# Altium project compute_fpga.PrjPcb (part 1 of 2)
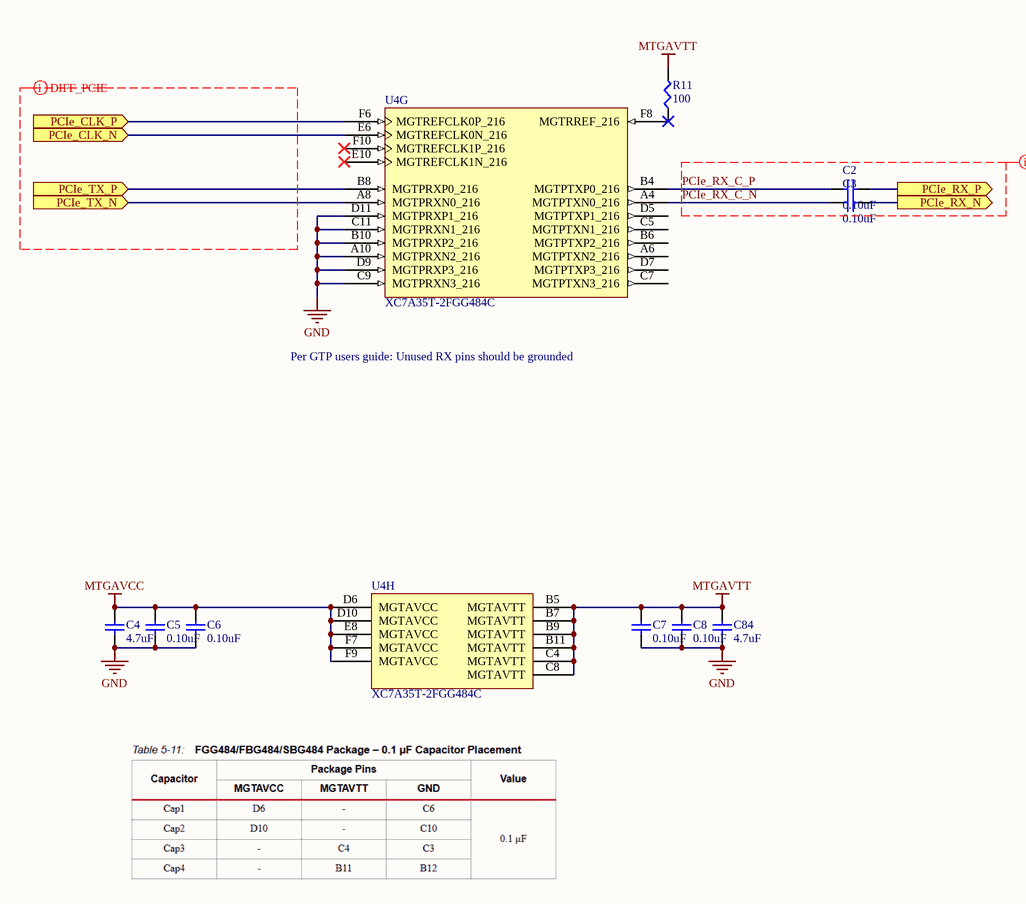
[diagram p0: FPGA PCIe.SchDoc]
Project: Raspberry Pincushion; VersionRevision: Rev0
14 sheets, 176 parts. Net scope: flat (ports and power ports of the same name join across sheets).
Board file: PCB1.PcbDoc
Sheets:
  FPGA PCIe.SchDoc
  FPGA power.SchDoc
  FPGA programming.SchDoc
  compute module.SchDoc
  compute module unused.SchDoc
  compute module power.SchDoc
  Block Diagram.SchDoc
  compute module Ethernet.SchDoc
  compute module HDMI out.SchDoc
  compute module microsd.SchDoc
  compute module USB.SchDoc
  FPGA GPIO.SchDoc
  FPGA power supply.SchDoc
  FPGA sdram.SchDoc

## Sheet FPGA PCIe.SchDoc: FPGA PCIe
size A4; Organization: Blinkinlabs, LLC; DocumentNumber: 10; SheetNumber: 11; SheetTotal: 14

### Parts
C2  0.10uF  [CAPC0603X03L]
C3  0.10uF  [CAPC0603X03L]
C4  4.7uF  [CAPC1005X06L]
C5  0.10uF  [CAPC0603X03L]
C6  0.10uF  [CAPC0603X03L]
C7  0.10uF  [CAPC0603X03L]
C8  0.10uF  [CAPC0603X03L]
C84  4.7uF  [CAPC1005X06L]
R11  100  [ERJ2G(0402)_L]
U4  XC7A35T-2FGG484C  [FGG484]  (parts G,H of 12)

### Ports
PCIe_CLK_N (in), PCIe_CLK_P (in), PCIe_RX_N (out), PCIe_RX_P (out), PCIe_TX_N (in), PCIe_TX_P (in)

### Nets
GND: C4.1 C5.2 C6.2 C7.2 C8.2 C84.1 U4.A10(MGTPRXN2_216) U4.B10(MGTPRXP2_216) U4.C9(MGTPRXN3_216) U4.C11(MGTPRXN1_216) U4.D9(MGTPRXP3_216) U4.D11(MGTPRXP1_216)
MTGAVCC: C4.2 C5.1 C6.1 U4.D6(MGTAVCC) U4.D10(MGTAVCC) U4.E8(MGTAVCC) U4.F7(MGTAVCC) U4.F9(MGTAVCC)
MTGAVTT: C7.1 C8.1 C84.2 R11.2 U4.B5(MGTAVTT) U4.B7(MGTAVTT) U4.B9(MGTAVTT) U4.B11(MGTAVTT) U4.C4(MGTAVTT) U4.C8(MGTAVTT)
PCIe_CLK_N: U4.E6(MGTREFCLK0N_216) ; port PCIe_CLK_N
PCIe_CLK_P: U4.F6(MGTREFCLK0P_216) ; port PCIe_CLK_P
PCIe_RX_C_N: C3.1 U4.A4(MGTPTXN0_216)
PCIe_RX_C_P: C2.1 U4.B4(MGTPTXP0_216)
PCIe_RX_N: C3.2 ; port PCIe_RX_N
PCIe_RX_P: C2.2 ; port PCIe_RX_P
PCIe_TX_N: U4.A8(MGTPRXN0_216) ; port PCIe_TX_N
PCIe_TX_P: U4.B8(MGTPRXP0_216) ; port PCIe_TX_P
NetR11_1: R11.1 U4.F8(MGTRREF_216)

Not connected (* = marked no-connect by the designer): U4 A6(MGTPTXN2_216) B6(MGTPTXP2_216) C5(MGTPTXN1_216) C7(MGTPTXN3_216) D5(MGTPTXP1_216) D7(MGTPTXP3_216) E10(MGTREFCLK1N_216)* F10(MGTREFCLK1P_216)*

### Layout directives
differential pair; differential pair class DIFF_90Ohm_PCIE; differential pair class DIFF_PCIE; net class PCIE; rule Matched Net Lengths [Tolerance = 0.1mm]: (no net found under the mark), PCIe_RX_C_N, PCIe_RX_C_P

### Notes on the sheet
- Per GTP users guide: Unused RX pins should be grounded
- Title:
- Project:
- Revision:
- Date:
- Time:
- Sheet
- of

### Library data of the parts
C2 C3 C5-C8 = GRM033R60J104KE19J: CAP CER 0.1UF 6.3V X5R 0201; Manufacturer: Murata Electronics North America; Tolerance: ±10%; Datasheets: http://www.murata.com/~/media/webrenewal/support/library/catalog/products/capacitor/mlcc/c02e.pdf; Image: //media.digikey.com/Renders/Murata%20Renders/ZRB-SERIES-0402.jpg; Digi-Key Part Number: 490-8155-1-ND; Packaging: Cut Tape (CT); Series: GRM; Value: 0.10uF; Voltage: 6.3V; Temperature Coefficient: X5R; Operating Temperature: -55°C ~ 85°C; Features: -; Applications: General Purpose; Mounting Type: 0201 (0603 Metric); Package / Case: 0.024" L x 0.012" W (0.60mm x 0.30mm); Case/Package: 0201
C4 C84 = GRM155R60G475ME47D: CAP CER 4.7UF 4V X5R 0402; Manufacturer: Murata Electronics North America; Tolerance: ±20%; PartNumber: GRM155R60G475ME47D; Datasheets: http://www.murata.com/~/media/webrenewal/support/library/catalog/products/capacitor/mlcc/c02e.pdf; Image: //media.digikey.com/Renders/Murata%20Renders/ZRB-SERIES-0402.jpg; Digi-Key Part Number: 490-11980-1-ND; Packaging: Cut Tape (CT); Series: GRM; Value: 4.7uF; Voltage: 4V; Temperature Coefficient: X5R; Operating Temperature: -55°C ~ 85°C; Features: -; Applications: General Purpose; Package / Case: 0402 (1005 Metric); Case/Package: 0402
R11 = ERJ-2RKF1000X: RES SMD 100 OHM 1% 1/10W 0402; Manufacturer: Panasonic Electronic Components; Power (Watts): 0.1W, 1/10W; Temperature Coefficient: ±100ppm/°C; PartNumber: ERJ-2RKF1000X; Datasheets: http://industrial.panasonic.com/www-cgi/jvcr13pz.cgi?E+PZ+3+AOA0002+ERJ2RKF1000X+7+WW; Image: //media.digikey.com/Photos/Panasonic%20Photos/ERJ-PA2-Series.jpg; Digi-Key Part Number: P100LCT-ND; Series: ERJ; Value: 100; Tolerance: ±1%; Composition: Thick Film; Features: Automotive AEC-Q200; Operating Temperature: -55°C ~ 155°C; Package / Case: 0402 (1005 Metric); Case/Package: 0402; Size / Dimension: 0.039" L x 0.020" W (1.00mm x 0.50mm); Height - Seated (Max): 0.016" (0.40mm); Number of Terminations: 2
U4 = CMP-0383-00019-1: Artix-7 FPGA, 250 User I/Os, 4 GTP, 484-Ball BGA, Speed Grade 2, Commercial Grade, Pb-Free; Manufacturer: Xilinx; Total Block RAM: 1800 Kb; GTP: 4; Available User I/O: 250; Speed Grades: 2; Logic Cells: 33280; CMTs: 5; ComponentLink3URL: http://www.xilinx.com/support/documentation/user_guides/ug475_7Series_Pkg_Pinout.pdf; PackageVersion: Rev. 1.11; ComponentLink2Description: Datasheet; ComponentLink3Description: Pinout; PartNumber: XC7A35T-2FGG484C; DatasheetVersion: Rev. 1.15; Operating Temperature Range: Commercial; PackageDescription: 484-Ball Wire-Bond Fine-Pitch BGA, Body 23 x 23 mm, Pitch 1 mm; ComponentLink4Description: Package Specification; Maximum Distributed RAM: 400 Kb; Mounting Technology: Surface Mount; ComponentLink2URL: http://www.xilinx.com/support/documentation/data_sheets/ds180_7Series_Overview.pdf; ComponentLink1Description: Manufacturer URL; ComponentLink4URL: http://www.xilinx.com/support/documentation/user_guides/ug475_7Series_Pkg_Pinout.pdf; PackageReference: FGG484; ComponentLink1URL: http://www.xilinx.com/

## Sheet FPGA power.SchDoc: FPGA power
size A4; Organization: Blinkinlabs, LLC; DocumentNumber: 11; SheetNumber: 12; SheetTotal: 14
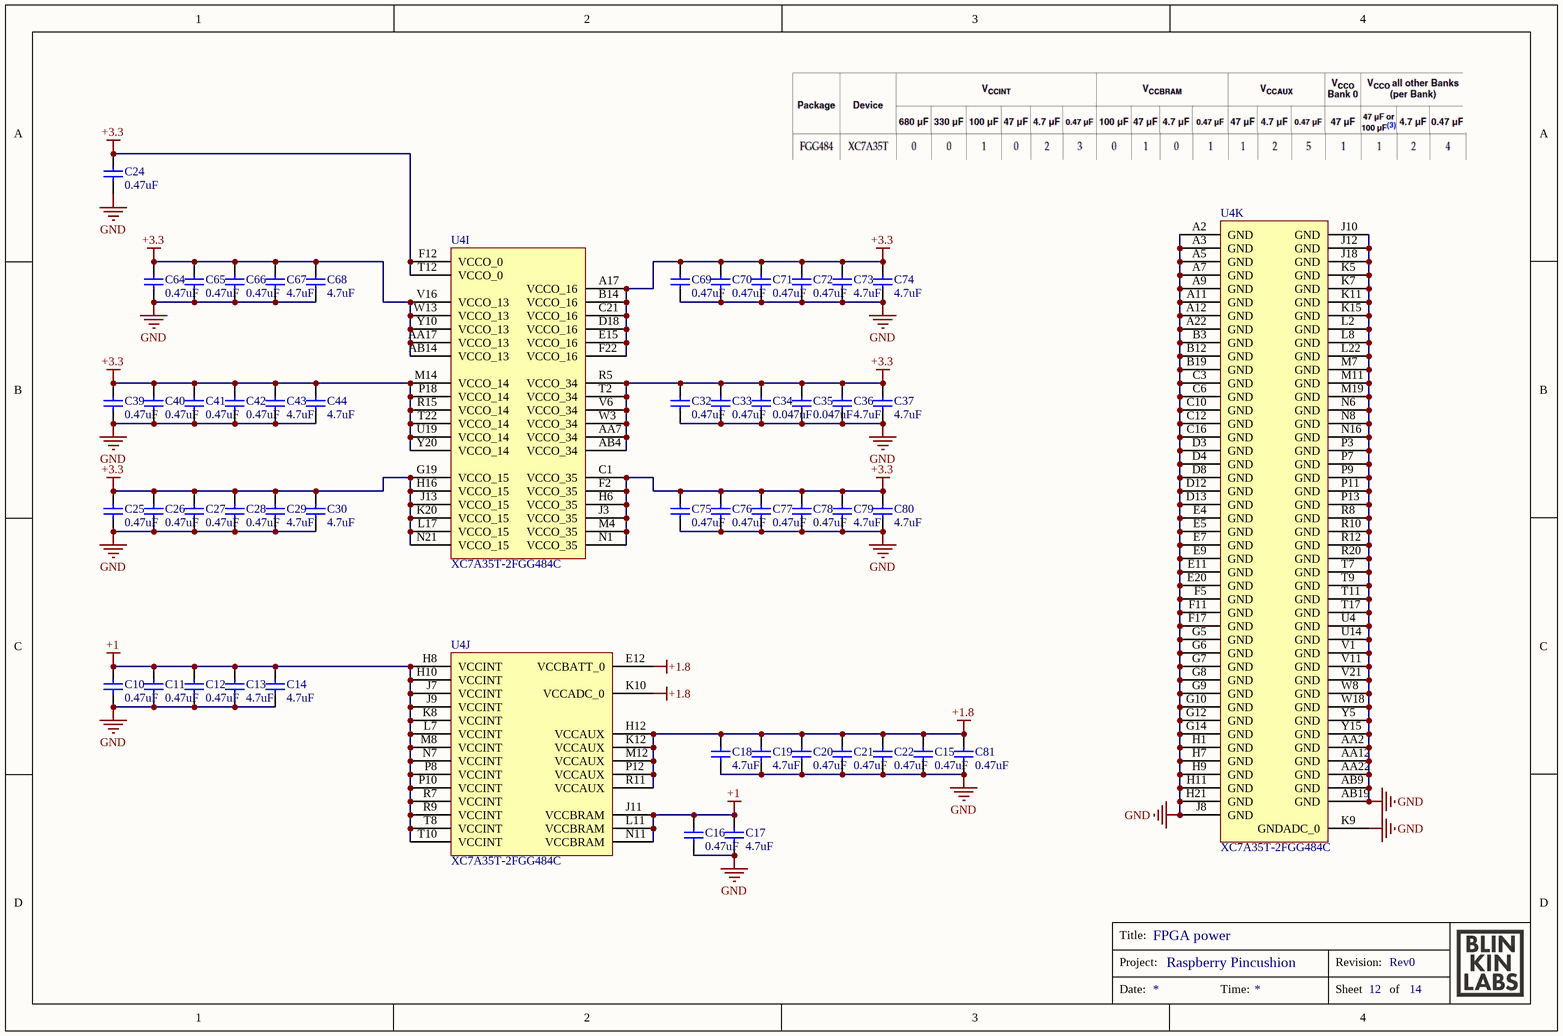
[diagram p1: FPGA power.SchDoc]

### Parts
C10  0.47uF  [CAPC1005X06L]
C11  0.47uF  [CAPC1005X06L]
C12  0.47uF  [CAPC1005X06L]
C13  4.7uF  [CAPC1005X06L]
C14  4.7uF  [CAPC1005X06L]
C15  0.47uF  [CAPC1005X06L]
C16  0.47uF  [CAPC1005X06L]
C17  4.7uF  [CAPC1005X06L]
C18  4.7uF  [CAPC1005X06L]
C19  4.7uF  [CAPC1005X06L]
C20  0.47uF  [CAPC1005X06L]
C21  0.47uF  [CAPC1005X06L]
C22  0.47uF  [CAPC1005X06L]
C24  0.47uF  [CAPC1005X06L]
C25  0.47uF  [CAPC1005X06L]
C26  0.47uF  [CAPC1005X06L]
C27  0.47uF  [CAPC1005X06L]
C28  0.47uF  [CAPC1005X06L]
C29  4.7uF  [CAPC1005X06L]
C30  4.7uF  [CAPC1005X06L]
C32  0.47uF  [CAPC1005X06L]
C33  0.47uF  [CAPC1005X06L]
C34  0.047uF  [CAPC1005X06L]
C35  0.047uF  [CAPC1005X06L]
C36  4.7uF  [CAPC1005X06L]
C37  4.7uF  [CAPC1005X06L]
C39  0.47uF  [CAPC1005X06L]
C40  0.47uF  [CAPC1005X06L]
C41  0.47uF  [CAPC1005X06L]
C42  0.47uF  [CAPC1005X06L]
C43  4.7uF  [CAPC1005X06L]
C44  4.7uF  [CAPC1005X06L]
C64  0.47uF  [CAPC1005X06L]
C65  0.47uF  [CAPC1005X06L]
C66  0.47uF  [CAPC1005X06L]
C67  4.7uF  [CAPC1005X06L]
C68  4.7uF  [CAPC1005X06L]
C69  0.47uF  [CAPC1005X06L]
C70  0.47uF  [CAPC1005X06L]
C71  0.47uF  [CAPC1005X06L]
C72  0.47uF  [CAPC1005X06L]
C73  4.7uF  [CAPC1005X06L]
C74  4.7uF  [CAPC1005X06L]
C75  0.47uF  [CAPC1005X06L]
C76  0.47uF  [CAPC1005X06L]
C77  0.47uF  [CAPC1005X06L]
C78  0.47uF  [CAPC1005X06L]
C79  4.7uF  [CAPC1005X06L]
C80  4.7uF  [CAPC1005X06L]
C81  0.47uF  [CAPC1005X06L]
U4  XC7A35T-2FGG484C  [FGG484]  (parts I,J,K of 12)

### Nets
+1: C10.1 C11.1 C12.1 C13.2 C14.2 C16.1 C17.2 U4.H8(VCCINT) U4.H10(VCCINT) U4.J7(VCCINT) U4.J9(VCCINT) U4.J11(VCCBRAM) U4.K8(VCCINT) U4.L7(VCCINT) U4.L11(VCCBRAM) U4.M8(VCCINT) U4.N7(VCCINT) U4.N11(VCCBRAM) U4.P8(VCCINT) U4.P10(VCCINT) U4.R7(VCCINT) U4.R9(VCCINT) U4.T8(VCCINT) U4.T10(VCCINT)
+1.8: C15.1 C18.2 C19.2 C20.1 C21.1 C22.1 C81.1 U4.E12(VCCBATT_0) U4.H12(VCCAUX) U4.K10(VCCADC_0) U4.K12(VCCAUX) U4.M12(VCCAUX) U4.P12(VCCAUX) U4.R11(VCCAUX)
+3.3: C24.1 C25.1 C26.1 C27.1 C28.1 C29.2 C30.2 C32.1 C33.1 C34.1 C35.1 C36.2 C37.2 C39.1 C40.1 C41.1 C42.1 C43.2 C44.2 C64.1 C65.1 C66.1 C67.2 C68.2 C69.1 C70.1 C71.1 C72.1 C73.2 C74.2 C75.1 C76.1 C77.1 C78.1 C79.2 C80.2 U4.A17(VCCO_16) U4.AA7(VCCO_34) U4.AA17(VCCO_13) U4.AB4(VCCO_34) U4.AB14(VCCO_13) U4.B14(VCCO_16) U4.C1(VCCO_35) U4.C21(VCCO_16) U4.D18(VCCO_16) U4.E15(VCCO_16) U4.F2(VCCO_35) U4.F12(VCCO_0) U4.F22(VCCO_16) U4.G19(VCCO_15) U4.H6(VCCO_35) U4.H16(VCCO_15) U4.J3(VCCO_35) U4.J13(VCCO_15) U4.K20(VCCO_15) U4.L17(VCCO_15) U4.M4(VCCO_35) U4.M14(VCCO_14) U4.N1(VCCO_35) U4.N21(VCCO_15) U4.P18(VCCO_14) U4.R5(VCCO_34) U4.R15(VCCO_14) U4.T2(VCCO_34) U4.T12(VCCO_0) U4.T22(VCCO_14) U4.U19(VCCO_14) U4.V6(VCCO_34) U4.V16(VCCO_13) U4.W3(VCCO_34) U4.W13(VCCO_13) U4.Y10(VCCO_13) U4.Y20(VCCO_14)
GND: C10.2 C11.2 C12.2 C13.1 C14.1 C15.2 C16.2 C17.1 C18.1 C19.1 C20.2 C21.2 C22.2 C24.2 C25.2 C26.2 C27.2 C28.2 C29.1 C30.1 C32.2 C33.2 C34.2 C35.2 C36.1 C37.1 C39.2 C40.2 C41.2 C42.2 C43.1 C44.1 C64.2 C65.2 C66.2 C67.1 C68.1 C69.2 C70.2 C71.2 C72.2 C73.1 C74.1 C75.2 C76.2 C77.2 C78.2 C79.1 C80.1 C81.2 U4.A2(GND) U4.A3(GND) U4.A5(GND) U4.A7(GND) U4.A9(GND) U4.A11(GND) U4.A12(GND) U4.A22(GND) U4.AA2(GND) U4.AA12(GND) U4.AA22(GND) U4.AB9(GND) U4.AB19(GND) U4.B3(GND) U4.B12(GND) U4.B19(GND) U4.C3(GND) U4.C6(GND) U4.C10(GND) U4.C12(GND) U4.C16(GND) U4.D3(GND) U4.D4(GND) U4.D8(GND) U4.D12(GND) U4.D13(GND) U4.E4(GND) U4.E5(GND) U4.E7(GND) U4.E9(GND) U4.E11(GND) U4.E20(GND) U4.F5(GND) U4.F11(GND) U4.F17(GND) U4.G5(GND) U4.G6(GND) U4.G7(GND) U4.G8(GND) U4.G9(GND) U4.G10(GND) U4.G12(GND) U4.G14(GND) U4.H1(GND) U4.H7(GND) U4.H9(GND) U4.H11(GND) U4.H21(GND) U4.J8(GND) U4.J10(GND) U4.J12(GND) U4.J18(GND) U4.K5(GND) U4.K7(GND) U4.K9(GNDADC_0) U4.K11(GND) U4.K15(GND) U4.L2(GND) U4.L8(GND) U4.L22(GND) U4.M7(GND) U4.M11(GND) U4.M19(GND) U4.N6(GND) U4.N8(GND) U4.N16(GND) U4.P3(GND) U4.P7(GND) U4.P9(GND) U4.P11(GND) U4.P13(GND) U4.R8(GND) U4.R10(GND) U4.R12(GND) U4.R20(GND) U4.T7(GND) U4.T9(GND) U4.T11(GND) U4.T17(GND) U4.U4(GND) U4.U14(GND) U4.V1(GND) U4.V11(GND) U4.V21(GND) U4.W8(GND) U4.W18(GND) U4.Y5(GND) U4.Y15(GND)

### Notes on the sheet
- Title:
- Project:
- Revision:
- Date:
- Time:
- Sheet
- of

### Library data of the parts
C10-C12 C15 C16 C20-C22 C24-C28 C32 C33 C39-C42 C64-C66 C69-C72 C75-C78 C81 = GRM155R60J474KE19D: CAP CER 0.47UF 6.3V X5R 0402; Manufacturer: Murata Electronics North America; Tolerance: ±10%; PartNumber: GRM155R60J474KE19D; Datasheets: http://www.murata.com/~/media/webrenewal/support/library/catalog/products/capacitor/mlcc/c02e.pdf; Image: //media.digikey.com/Renders/Murata%20Renders/ZRB-SERIES-0402.jpg; Digi-Key Part Number: 490-3266-1-ND; Packaging: Cut Tape (CT); Series: GRM; Value: 0.47uF; Voltage: 6.3V; Temperature Coefficient: X5R; Operating Temperature: -55°C ~ 85°C; Features: -; Applications: General Purpose; Package / Case: 0402 (1005 Metric); Case/Package: 0402
C13 C14 C17-C19 C29 C30 C36 C37 C43 C44 C67 C68 C73 C74 C79 C80 = GRM155R60G475ME47D: as C4 on sheet FPGA PCIe; PartNumber: GRM155R60G475ME47D; Datasheets: http://www.murata.com/~/media/webrenewal/support/library/catalog/products/capacitor/mlcc/c02e.pdf; Image: //media.digikey.com/Renders/Murata%20Renders/ZRB-SERIES-0402.jpg; Digi-Key Part Number: 490-11980-1-ND; Packaging: Cut Tape (CT); Series: GRM; Value: 4.7uF; Voltage: 4V; Temperature Coefficient: X5R; Operating Temperature: -55°C ~ 85°C; Features: -; Applications: General Purpose; Package / Case: 0402 (1005 Metric); Case/Package: 0402
C34 C35 = GRM155R60J473KA01D: CAP CER 0.047UF 6.3V X5R 0402; Manufacturer: Murata Electronics North America; Tolerance: ±10%; PartNumber: GRM155R60J473KA01D; Datasheets: http://www.murata.com/~/media/webrenewal/support/library/catalog/products/capacitor/mlcc/c02e.pdf; Image: //media.digikey.com/Renders/Murata%20Renders/ZRB-SERIES-0402.jpg; Digi-Key Part Number: 490-8250-1-ND; Packaging: Cut Tape (CT); Series: GRM; Value: 0.047uF; Voltage: 6.3V; Temperature Coefficient: X5R; Operating Temperature: -55°C ~ 85°C; Features: -; Applications: General Purpose; Package / Case: 0402 (1005 Metric); Case/Package: 0402
U4 = CMP-0383-00019-1: as U4 on sheet FPGA PCIe; ComponentLink3URL: http://www.xilinx.com/support/documentation/user_guides/ug475_7Series_Pkg_Pinout.pdf; PackageVersion: Rev. 1.11; ComponentLink2Description: Datasheet; ComponentLink3Description: Pinout; PartNumber: XC7A35T-2FGG484C; DatasheetVersion: Rev. 1.15; Operating Temperature Range: Commercial; PackageDescription: 484-Ball Wire-Bond Fine-Pitch BGA, Body 23 x 23 mm, Pitch 1 mm; ComponentLink4Description: Package Specification; Maximum Distributed RAM: 400 Kb; Mounting Technology: Surface Mount; ComponentLink2URL: http://www.xilinx.com/support/documentation/data_sheets/ds180_7Series_Overview.pdf; ComponentLink1Description: Manufacturer URL; ComponentLink4URL: http://www.xilinx.com/support/documentation/user_guides/ug475_7Series_Pkg_Pinout.pdf; PackageReference: FGG484; ComponentLink1URL: http://www.xilinx.com/

## Sheet FPGA programming.SchDoc: FPGA Configuration
size A4; Organization: Blinkinlabs, LLC; DocumentNumber: 12; SheetNumber: 13; SheetTotal: 14
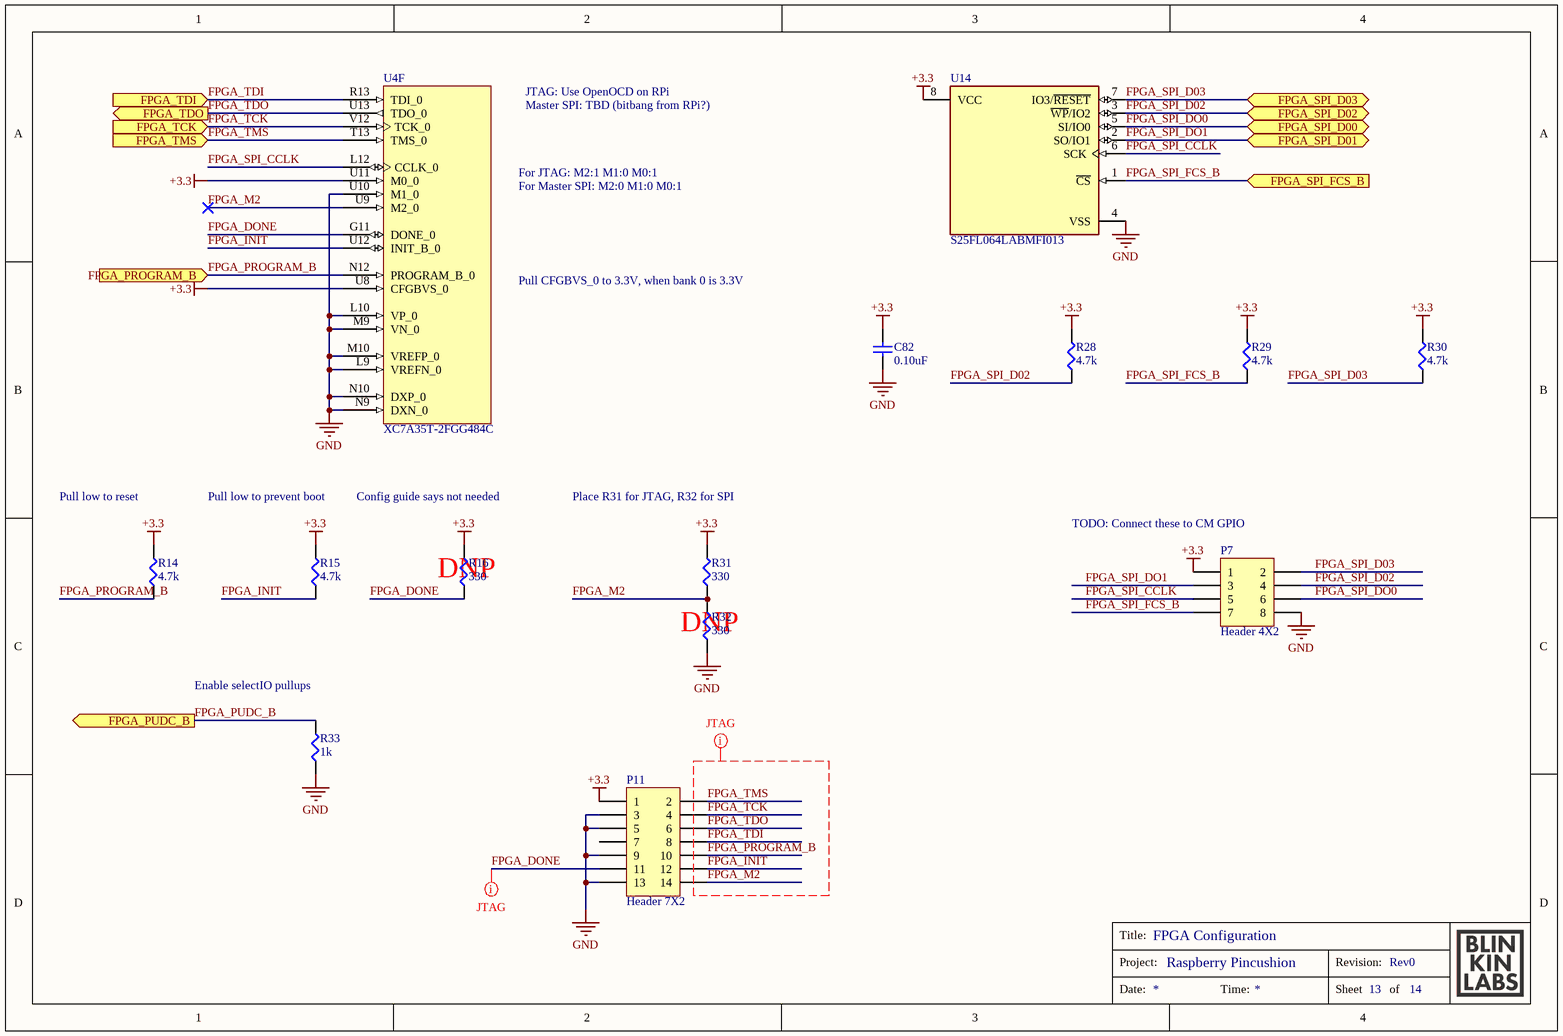
[diagram p2: FPGA programming.SchDoc]

### Parts
C82  0.10uF  [CAPC1005X06L]
P7  Header 4X2  [HDR2X4]
P11  Header 7X2  [HDR2X7]
R14  4.7k  [ERJ2G(0402)_L]
R15  4.7k  [ERJ2G(0402)_L]
R16  330  [ERJ2G(0402)_L]
R28  4.7k  [ERJ2G(0402)_L]
R29  4.7k  [ERJ2G(0402)_L]
R30  4.7k  [ERJ2G(0402)_L]
R31  330  [ERJ2G(0402)_L]
R32  330  [ERJ2G(0402)_L]
R33  1k  [ERJ2G(0402)_L]
U4  XC7A35T-2FGG484C  [FGG484]  (part F of 12)
U14  S25FL064LABMFI013  [FP-002-15548-MFG]

### Ports
FPGA_PROGRAM_B (in), FPGA_PUDC_B (out), FPGA_SPI_D00 (bidir), FPGA_SPI_D01 (bidir), FPGA_SPI_D02 (bidir), FPGA_SPI_D03 (bidir), FPGA_SPI_FCS_B (in), FPGA_TCK (in), FPGA_TDI (in), FPGA_TDO (out), FPGA_TMS (in)

### Nets
+3.3: C82.2 P7.1 P11.1 R14.2 R15.2 R16.2 R28.2 R29.2 R30.2 R31.2 U4.U8(CFGBVS_0) U4.U11(M0_0) U14.8(VCC)
GND: C82.1 P7.8 P11.3 P11.5 P11.9 P11.13 R32.1 R33.1 U4.L9(VREFN_0) U4.L10(VP_0) U4.M9(VN_0) U4.M10(VREFP_0) U4.N9(DXN_0) U4.N10(DXP_0) U4.U10(M1_0) U14.4(VSS)
FPGA_DONE: P11.11 R16.1 U4.G11(DONE_0)
FPGA_INIT: P11.12 R15.1 U4.U12(INIT_B_0)
FPGA_M2: P11.14 R31.1 R32.2 U4.U9(M2_0)
FPGA_PROGRAM_B: P11.10 R14.1 U4.N12(PROGRAM_B_0) ; port FPGA_PROGRAM_B
FPGA_PUDC_B: R33.2 ; port FPGA_PUDC_B
FPGA_SPI_CCLK: P7.5 U4.L12(CCLK_0) U14.6(SCK)
FPGA_SPI_D02: P7.4 R28.1 U14.3(~{WP}/IO2) ; port FPGA_SPI_D02
FPGA_SPI_D03: P7.2 R30.1 U14.7(IO3/~{RESET}) ; port FPGA_SPI_D03
FPGA_SPI_DO0: P7.6 U14.5(SI/IO0) ; port FPGA_SPI_D00
FPGA_SPI_DO1: P7.3 U14.2(SO/IO1) ; port FPGA_SPI_D01
FPGA_SPI_FCS_B: P7.7 R29.1 U14.1(~{CS}) ; port FPGA_SPI_FCS_B
FPGA_TCK: P11.4 U4.V12(TCK_0) ; port FPGA_TCK
FPGA_TDI: P11.8 U4.R13(TDI_0) ; port FPGA_TDI
FPGA_TDO: P11.6 U4.U13(TDO_0) ; port FPGA_TDO
FPGA_TMS: P11.2 U4.T13(TMS_0) ; port FPGA_TMS

Not connected (* = marked no-connect by the designer): P11 7

### Layout directives
net class JTAG: FPGA_DONE, FPGA_INIT, FPGA_M2, FPGA_PROGRAM_B, FPGA_TCK, FPGA_TDI, FPGA_TDO, FPGA_TMS

### Notes on the sheet
- JTAG: Use OpenOCD on RPi
- Master SPI: TBD (bitbang from RPi?)
- For JTAG: M2:1 M1:0 M0:1
- For Master SPI: M2:0 M1:0 M0:1
- Pull CFGBVS_0 to 3.3V, when bank 0 is 3.3V
- Pull low to reset
- Pull low to prevent boot
- Config guide says not needed
- Place R31 for JTAG, R32 for SPI
- (near R16) DNP
- (near P7) TODO: Connect these to CM GPIO
- (near R32) DNP
- (near R33) Enable selectIO pullups
- Title:
- Project:
- Revision:
- Date:
- Time:
- Sheet
- of

### Library data of the parts
C82 = GRM155R61A104KA01D: CAP CER 0.1UF 10V X5R 0402; Manufacturer: Murata Electronics North America; Tolerance: ±10%; PartNumber: GRM155R61A104KA01D; Datasheets: http://www.murata.com/~/media/webrenewal/support/library/catalog/products/capacitor/mlcc/c02e.pdf; Image: //media.digikey.com/Renders/Murata%20Renders/ZRB-SERIES-0402.jpg; Digi-Key Part Number: 490-1318-1-ND; Packaging: Cut Tape (CT); Series: GRM; Value: 0.10uF; Voltage: 10V; Temperature Coefficient: X5R; Operating Temperature: -55°C ~ 85°C; Features: -; Applications: General Purpose; Package / Case: 0402 (1005 Metric); Case/Package: 0402
P7 = Header 4X2: Header, 4-Pin, Dual row; LatestRevisionDate: 17-Jul-2002; LatestRevisionNote: Re-released for DXP Platform.; Publisher: Altium Limited
P11 = Header 7X2: Header, 7-Pin, Dual row; LatestRevisionDate: 17-Jul-2002; LatestRevisionNote: Re-released for DXP Platform.; Publisher: Altium Limited
R14 R15 R28-R30 = ERJ-PA2F4701X: RES SMD 4.7K OHM 1% 1/5W 0402; Manufacturer: Panasonic Electronic Components; Power (Watts): 0.2W, 1/5W; Temperature Coefficient: ±100ppm/°C; PartNumber: ERJ-PA2F4701X; Datasheets: https://industrial.panasonic.com/cdbs/www-data/pdf/RDA0000/AOA0000C243.pdf; Image: //media.digikey.com/Photos/Panasonic%20Photos/ERJ-PA2-Series.jpg; Digi-Key Part Number: P17228CT-ND; Series: ERJ; Value: 4.7k; Tolerance: ±1%; Composition: Thick Film; Features: Automotive AEC-Q200, Pulse Withstanding; Operating Temperature: -55°C ~ 155°C; Package / Case: 0402 (1005 Metric); Case/Package: 0402; Size / Dimension: 0.039" L x 0.020" W (1.00mm x 0.50mm); Height - Seated (Max): 0.016" (0.40mm); Number of Terminations: 2
R16 R31 R32 = ERJ-2RKF3300X: RES SMD 330 OHM 1% 1/10W 0402; Manufacturer: Panasonic Electronic Components; Power (Watts): 0.1W, 1/10W; Temperature Coefficient: ±100ppm/°C; PartNumber: ERJ-2RKF3300X; Datasheets: http://industrial.panasonic.com/www-cgi/jvcr13pz.cgi?E+PZ+3+AOA0002+ERJ2RKF3300X+7+WW; Image: //media.digikey.com/Photos/Panasonic%20Photos/ERJ-PA2-Series.jpg; Digi-Key Part Number: P330LCT-ND; Series: ERJ; Value: 330; Tolerance: ±1%; Composition: Thick Film; Features: Automotive AEC-Q200; Operating Temperature: -55°C ~ 155°C; Package / Case: 0402 (1005 Metric); Case/Package: 0402; Size / Dimension: 0.039" L x 0.020" W (1.00mm x 0.50mm); Height - Seated (Max): 0.016" (0.40mm); Number of Terminations: 2
R33 = ERJ-2RKF1001X: RES SMD 1K OHM 1% 1/10W 0402; Manufacturer: Panasonic Electronic Components; Power (Watts): 0.1W, 1/10W; Temperature Coefficient: ±100ppm/°C; PartNumber: ERJ-2RKF1001X; Datasheets: http://industrial.panasonic.com/www-cgi/jvcr13pz.cgi?E+PZ+3+AOA0002+ERJ2RKF1001X+7+WW; Image: //media.digikey.com/Photos/Panasonic%20Photos/ERJ-PA2-Series.jpg; Digi-Key Part Number: P1.00KLCT-ND; Series: ERJ; Value: 1k; Tolerance: ±1%; Composition: Thick Film; Features: Automotive AEC-Q200; Operating Temperature: -55°C ~ 155°C; Package / Case: 0402 (1005 Metric); Case/Package: 0402; Size / Dimension: 0.039" L x 0.020" W (1.00mm x 0.50mm); Height - Seated (Max): 0.016" (0.40mm); Number of Terminations: 2
U4 = CMP-0383-00019-1: as U4 on sheet FPGA PCIe; ComponentLink3URL: http://www.xilinx.com/support/documentation/user_guides/ug475_7Series_Pkg_Pinout.pdf; PackageVersion: Rev. 1.11; ComponentLink2Description: Datasheet; ComponentLink3Description: Pinout; PartNumber: XC7A35T-2FGG484C; DatasheetVersion: Rev. 1.15; Operating Temperature Range: Commercial; PackageDescription: 484-Ball Wire-Bond Fine-Pitch BGA, Body 23 x 23 mm, Pitch 1 mm; ComponentLink4Description: Package Specification; Maximum Distributed RAM: 400 Kb; Mounting Technology: Surface Mount; ComponentLink2URL: http://www.xilinx.com/support/documentation/data_sheets/ds180_7Series_Overview.pdf; ComponentLink1Description: Manufacturer URL; ComponentLink4URL: http://www.xilinx.com/support/documentation/user_guides/ug475_7Series_Pkg_Pinout.pdf; PackageReference: FGG484; ComponentLink1URL: http://www.xilinx.com/
U14 = CMP-12948-000004-1: IC FLASH 64M SPI 108MHZ 8SOIC; Manufacturer: Cypress Semiconductor; Standoff Height: 0.05mm; Access Time: 8ns; Nominal Supply Current: 10-20mA; Max Supply Voltage: 3.6V; Memory Size: 64Mbits; Interface: SPI,Other; Memory Type: FLASH,NOR; Min Supply Voltage: 2.7V; Octopart: https://octopart.com/s25fl064labmfi013-cypress+semiconductor-81630477; Device Class L2: Memory; Frequency: 108MHz; Device Class L3: Flash; Digikey Description: IC FLASH 64M SPI 108MHZ 8SOIC; Device Class L1: Integrated Circuits (ICs); ComponentLink2URL: https://www.cypress.com/file/316661/download; ComponentLink2Description: Datasheet; Temperature Range High: +85°C; Temperature Range Low: -40°C; Ambient Temperature Range High: +85°C; Footprint Url: http://www.cypress.com/file/217366/download; RoHS: TRUE; Temperature: -40°C to +85°C; Package: 002-15548; Automotive: No; Lead Free: Yes; Mouser Description: IC FLASH NOR 8SOIC; Ambient Temperature Range Low: -40°C; Height: 2.16mm; Category: IC; Manufacturer Part Number: S25FL064LABMFI013

## Sheet compute module.SchDoc: Compute Module
size A4; Organization: Blinkinlabs, LLC; DocumentNumber: 2; SheetNumber: 2; SheetTotal: 14
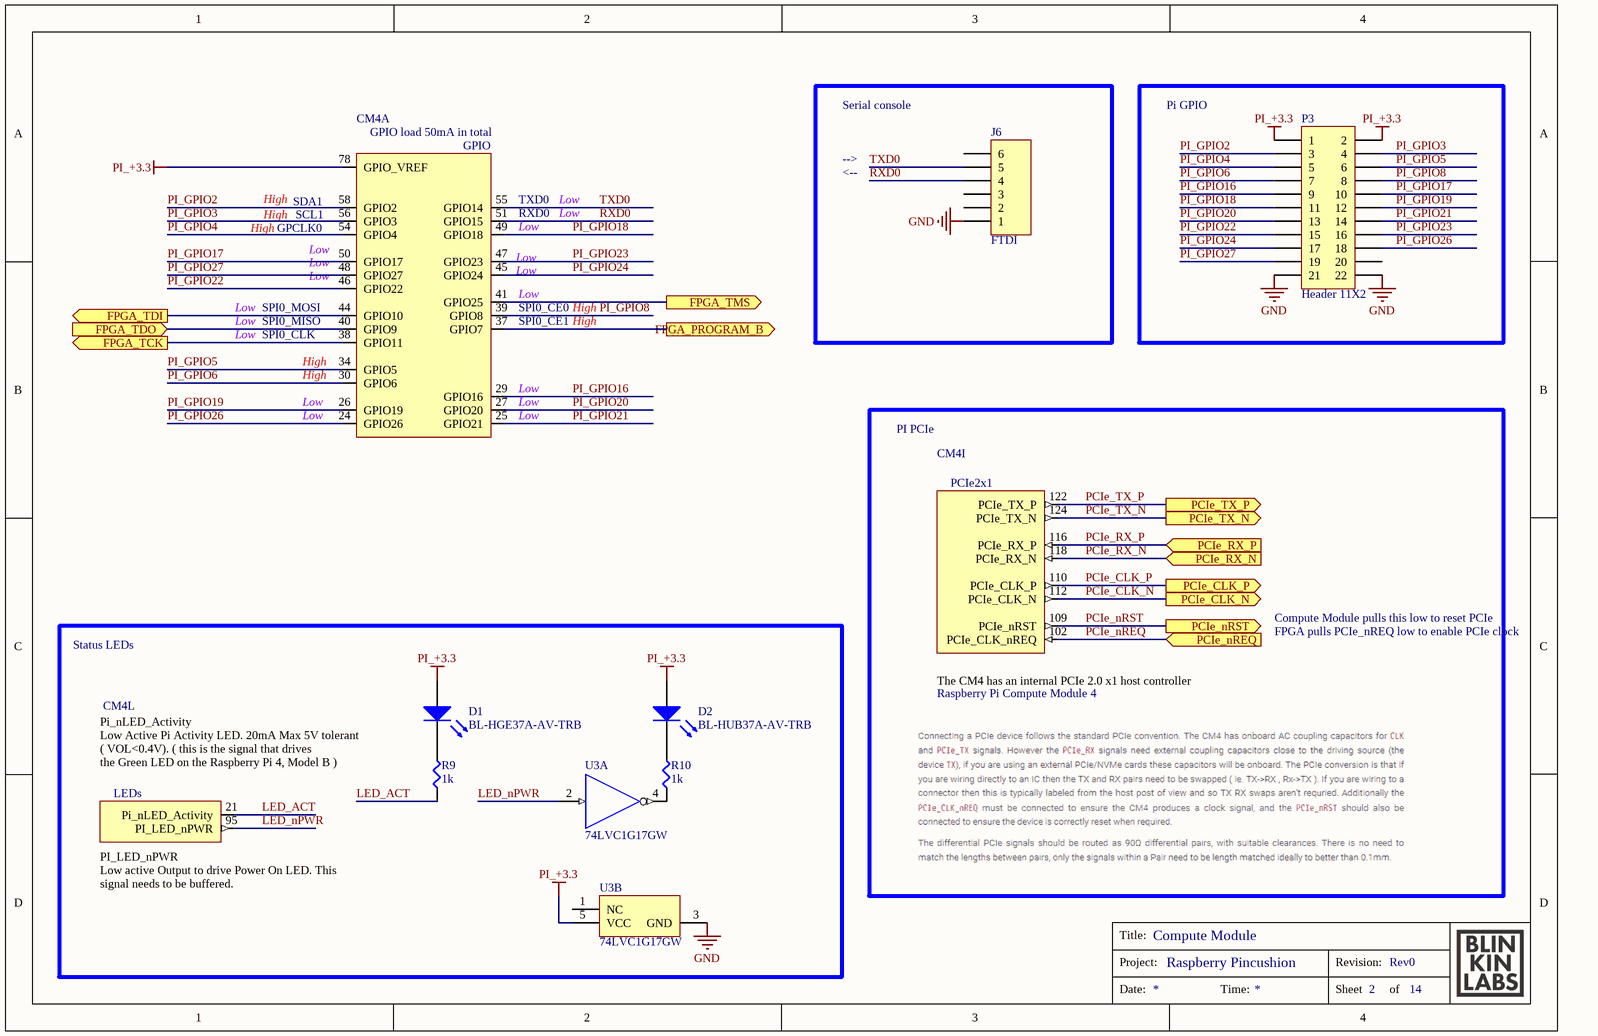
[diagram p3: compute module.SchDoc]

### Parts
CM4  Raspberry Pi Compute Module 4  [CM4-F40C-100DS-0.4v_1.5mm_0mm]  (value not drawn)  (parts A,I,L of 21)
D1  BL-HGE37A-AV-TRB  [BL-Hxx37A-AV-TRB]
D2  BL-HUB37A-AV-TRB  [BL-Hxx37A-AV-TRB]
J6  FTDI  [HDR1X6]
P3  Header 11X2  [HDR2X11]
R9  1k  [ERJ2G(0402)_L]
R10  1k  [ERJ2G(0402)_L]
U3  74LVC1G17GW  [NXP-SOT353-1_L]  (parts A,B of 2)

### Blocks framed on the sheet
Pi GPIO: P3
Status LEDs: CM4 D1 D2 R9 R10 U3

### Ports
FPGA_PROGRAM_B (out), FPGA_TCK (out), FPGA_TDI (out), FPGA_TDO (in), FPGA_TMS (out), PCIe_CLK_N (out), PCIe_CLK_P (out), PCIe_nREQ (in), PCIe_nRST (out), PCIe_RX_N (in), PCIe_RX_P (in), PCIe_TX_N (out), PCIe_TX_P (out)

### Nets
GND: J6.1 P3.21 P3.22 U3.3(GND)
PI_+3.3: CM4.78(GPIO_VREF) D1.1 D2.1 P3.1 P3.2 U3.5(VCC)
FPGA_PROGRAM_B: CM4.37(GPIO7) ; port FPGA_PROGRAM_B
FPGA_TCK: CM4.38(GPIO11) ; port FPGA_TCK
FPGA_TDI: CM4.44(GPIO10) ; port FPGA_TDI
FPGA_TDO: CM4.40(GPIO9) ; port FPGA_TDO
FPGA_TMS: CM4.41(GPIO25) ; port FPGA_TMS
LED_ACT: CM4.21(Pi_nLED_Activity) R9.1
LED_nPWR: CM4.95(PI_LED_nPWR) U3.2(A)
PCIe_CLK_N: CM4.112(PCIe_CLK_N) ; port PCIe_CLK_N
PCIe_CLK_P: CM4.110(PCIe_CLK_P) ; port PCIe_CLK_P
PCIe_nREQ: CM4.102(PCIe_CLK_nREQ) ; port PCIe_nREQ
PCIe_nRST: CM4.109(PCIe_nRST) ; port PCIe_nRST
PCIe_RX_N: CM4.118(PCIe_RX_N) ; port PCIe_RX_N
PCIe_RX_P: CM4.116(PCIe_RX_P) ; port PCIe_RX_P
PCIe_TX_N: CM4.124(PCIe_TX_N) ; port PCIe_TX_N
PCIe_TX_P: CM4.122(PCIe_TX_P) ; port PCIe_TX_P
PI_GPIO2: CM4.58(GPIO2) P3.3
PI_GPIO3: CM4.56(GPIO3) P3.4
PI_GPIO4: CM4.54(GPIO4) P3.5
PI_GPIO5: CM4.34(GPIO5) P3.6
PI_GPIO6: CM4.30(GPIO6) P3.7
PI_GPIO8: CM4.39(GPIO8) P3.8
PI_GPIO16: CM4.29(GPIO16) P3.9
PI_GPIO17: CM4.50(GPIO17) P3.10
PI_GPIO18: CM4.49(GPIO18) P3.11
PI_GPIO19: CM4.26(GPIO19) P3.12
PI_GPIO20: CM4.27(GPIO20) P3.13
PI_GPIO21: CM4.25(GPIO21) P3.14
PI_GPIO22: CM4.46(GPIO22) P3.15
PI_GPIO23: CM4.47(GPIO23) P3.16
PI_GPIO24: CM4.45(GPIO24) P3.17
PI_GPIO26: CM4.24(GPIO26) P3.18
PI_GPIO27: CM4.48(GPIO27) P3.19
RXD0: CM4.51(GPIO15) J6.4
TXD0: CM4.55(GPIO14) J6.5
NetD1_2: D1.2 R9.2
NetD2_2: D2.2 R10.2
NetR10_1: R10.1 U3.4(~{Y})

Not connected (* = marked no-connect by the designer): J6 2 3 6; P3 20; U3 1(NC)

### Notes on the sheet
- Serial console
- <--
- -->
- PI PCIe
- Compute Module pulls this low to reset PCIe
- FPGA pulls PCIe_nREQ low to enable PCIe clock
- Title:
- Project:
- Revision:
- Date:
- Time:
- Sheet
- of
- (in symbol CM4, part A) GPIO load 50mA in total; GPIO; High; SDA1; TXD0; Low; SCL1; RXD0; GPCLK0; SPI0_MOSI; SPI0_CE0; SPI0_MISO; SPI0_CE1; SPI0_CLK; by Amornthep Phunsin
- (in symbol CM4, part I) PCIe2x1; The CM4 has an internal PCIe 2.0 x1 host controller
- (in symbol CM4, part L) Pi_nLED_Activity / Low Active Pi Activity LED. 20mA Max 5V tolerant ( VOL<0.4V). ( this is the signal that drives / the Green LED on the Raspberry Pi 4, Model B ); LEDs; PI_LED_nPWR / Low active Output to drive Power On LED. This signal needs to be buffered.

### Library data of the parts
CM4 = CM4: Raspberry Pi Compute Module 4 by Amornthep Phunsin
D1 = BL-HGE37A-AV-TRB: LED, 0402, Super Yellow Green, 35mcd@20mA, 566~576nm; Manufacturer: BrtLed(佰鸿); PartNumber: BL-HGE37A-AV-TRB; LCSC PartNumber: C165979
D2 = BL-HUB37A-AV-TRB: LED, 0402, Super Red, 50mcd@20mA, 627~637nm; Manufacturer: BrtLed(佰鸿); PartNumber: BL-HUB37A-AV-TRB; LCSC PartNumber: C165980
J6 = Header 6: Header, 6-Pin; LatestRevisionDate: 17-Jul-2002; LatestRevisionNote: Re-released for DXP Platform.; Publisher: Altium Limited
P3 = Header 11X2: Header, 11-Pin, Dual row; LatestRevisionDate: 17-Jul-2002; LatestRevisionNote: Re-released for DXP Platform.; Publisher: Altium Limited
R9 R10 = ERJ-2GEJ102X: RES SMD 1K OHM 5% 1/10W 0402; Manufacturer: Panasonic Electronic Components; Power (Watts): 0.1W, 1/10W; Temperature Coefficient: ±200ppm/°C; PartNumber: ERJ-2GEJ102X; Datasheets: http://industrial.panasonic.com/www-cgi/jvcr13pz.cgi?E+PZ+3+AOA0001+ERJ2GEJ102X+7+WW; Image: //media.digikey.com/Photos/Panasonic%20Photos/ERJ-PA2-Series.jpg; Digi-Key Part Number: P1.0KJCT-ND; Series: ERJ; Value: 1k; Tolerance: ±5%; Composition: Thick Film; Features: Automotive AEC-Q200; Operating Temperature: -55°C ~ 155°C; Package / Case: 0402 (1005 Metric); Case/Package: 0402; Size / Dimension: 0.039" L x 0.020" W (1.00mm x 0.50mm); Height - Seated (Max): 0.016" (0.40mm); Number of Terminations: 2
U3 = CMP-2000-05689-1: Single Schmitt Trigger Buffer, 1.65 to 5.5 V, -40 to 125 degC, 5-Pin TSSOP (SOT353-1), RoHS, Tape and Reel; Manufacturer: NXP Semiconductors; Output Type: SingleEnded; Maximum High Level Output Current: -32mA; Maximum Propagation Delay Time @ Maximum CL: 14ns; Maximum Operating Supply Voltage: 5.5V; Schmitt Trigger Input: Yes; Number of Channels: 1; Minimum Operating Supply Voltage: 1.65V; Polarity: Non-Inverting; Logic Family: LVC; Maximum Low Level Output Current: 32mA; Width: 1.35mm; Maximum Operating Temperature: +125°C; Package Description: 5-Pin Thin Shrink Small Outline Package, Body 2.05 x 1.25 mm, Pitch 0.65 mm; Length: 2.25mm; Package Type: TSSOP; Dimensions: 2.25x1.35x1mm; Datasheet URL: http://www.nxp.com/documents/data_sheet/74LVC1G17.pdf?fasp=1&WT_TYPE=Data%20Sheets&WT_VENDOR=FREESCALE&WT_FILE_FORMAT=pdf&WT_ASSET=Documentation&fileExt=.pdf; Package Reference: SOT353-1; Mounting Technology: SurfaceMount; Logic Function: Buffer; Package URL: http://www.nxp.com/documents/outline_drawing/SOT353-1.pdf; Input Type: SchmittTrigger; Mounting Type: SurfaceMount; Datasheet Version: Rev. 10, 06/2012; Manufacturer URL: http://www.nxp.com/; Pin Count: 5; Height: 1mm; Minimum Operating Temperature: -40°C; PartId: 1

## Sheet compute module unused.SchDoc: Compute Module Unused
size A4; Organization: Blinkinlabs, LLC; DocumentNumber: 8; SheetNumber: 8; SheetTotal: 14
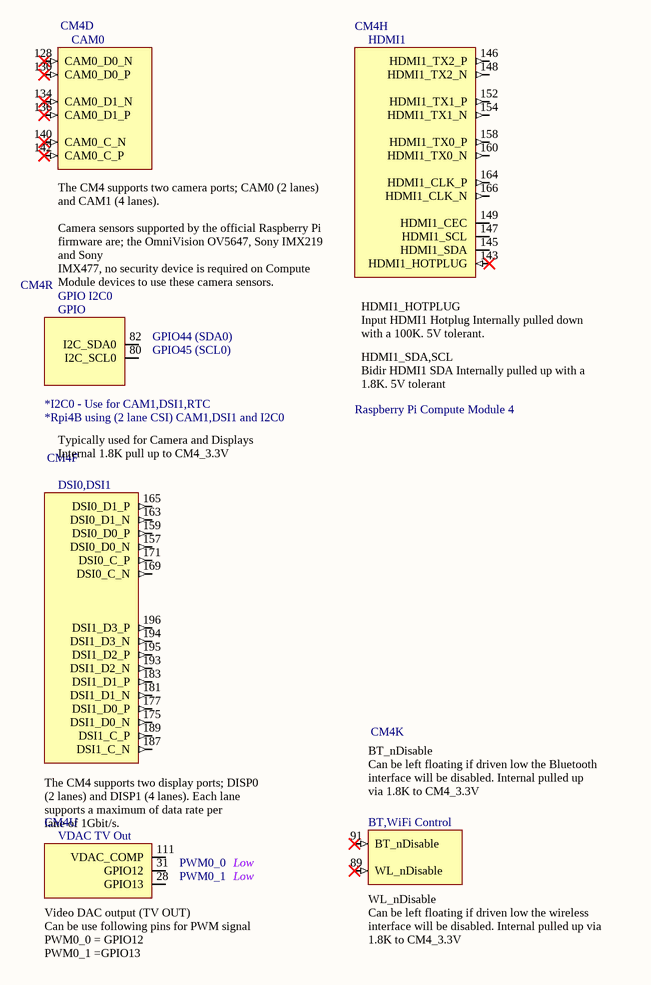
[diagram p4: compute module unused.SchDoc]

### Parts
CM4  Raspberry Pi Compute Module 4  [CM4-F40C-100DS-0.4v_1.5mm_0mm]  (value not drawn)  (parts D,F,H,K,R,U of 21)

### Nets

Not connected (* = marked no-connect by the designer): CM4 28(GPIO13) 31(GPIO12) 80(I2C_SCL0) 82(I2C_SDA0) 89(WL_nDisable)* 91(BT_nDisable)* 111(VDAC_COMP) 128(CAM0_D0_N)* 130(CAM0_D0_P)* 134(CAM0_D1_N)* 136(CAM0_D1_P)* 140(CAM0_C_N)* 142(CAM0_C_P)* 143(HDMI1_HOTPLUG)* 145(HDMI1_SDA) 146(HDMI1_TX2_P) 147(HDMI1_SCL) 148(HDMI1_TX2_N) 149(HDMI1_CEC) 152(HDMI1_TX1_P) 154(HDMI1_TX1_N) 157(DSI0_D0_N) 158(HDMI1_TX0_P) 159(DSI0_D0_P) 160(HDMI1_TX0_N) 163(DSI0_D1_N) 164(HDMI1_CLK_P) 165(DSI0_D1_P) 166(HDMI1_CLK_N) 169(DSI0_C_N) 171(DSI0_C_P) 175(DSI1_D0_N) 177(DSI1_D0_P) 181(DSI1_D1_N) 183(DSI1_D1_P) 187(DSI1_C_N) 189(DSI1_C_P) 193(DSI1_D2_N) 194(DSI1_D3_N) 195(DSI1_D2_P) 196(DSI1_D3_P)

### Notes on the sheet
- Title:
- Project:
- Revision:
- Date:
- Time:
- Sheet
- of
- (in symbol CM4, part D) CAM0; The CM4 supports two camera ports; CAM0 (2 lanes) and CAM1 (4 lanes). / Camera sensors supported by the official Raspberry Pi firmware are; the OmniVision OV5647, Sony IMX219 and Sony / IMX477, no security device is required on Compute Module devices to use these camera sensors.
- (in symbol CM4, part F) DSI0,DSI1; The CM4 supports two display ports; DISP0 (2 lanes) and DISP1 (4 lanes). Each lane supports a maximum of data rate per / lane of 1Gbit/s.
- (in symbol CM4, part H) HDMI1; HDMI1_HOTPLUG / Input HDMI1 Hotplug Internally pulled down with a 100K. 5V tolerant.; HDMI1_SDA,SCL / Bidir HDMI1 SDA Internally pulled up with a 1.8K. 5V tolerant
- (in symbol CM4, part K) BT_nDisable / Can be left floating if driven low the Bluetooth interface will be disabled. Internal pulled up / via 1.8K to CM4_3.3V; BT,WiFi Control; WL_nDisable / Can be left floating if driven low the wireless interface will be disabled. Internal pulled up via / 1.8K to CM4_3.3V
- (in symbol CM4, part R) GPIO I2C0; GPIO; GPIO44 (SDA0); GPIO45 (SCL0); *I2C0 - Use for CAM1,DSI1,RTC; *Rpi4B using (2 lane CSI) CAM1,DSI1 and I2C0; Typically used for Camera and Displays Internal 1.8K pull up to CM4_3.3V
- (in symbol CM4, part U) VDAC TV Out; PWM0_0; Low; PWM0_1; Video DAC output (TV OUT) / Can be use following pins for PWM signal / PWM0_0 = GPIO12 / PWM0_1 =GPIO13

### Library data of the parts
CM4 = CM4: as CM4 on sheet compute module

## Sheet compute module power.SchDoc: Compute Module power
size A4; Organization: Blinkinlabs, LLC; DocumentNumber: 3; SheetNumber: 3; SheetTotal: 14
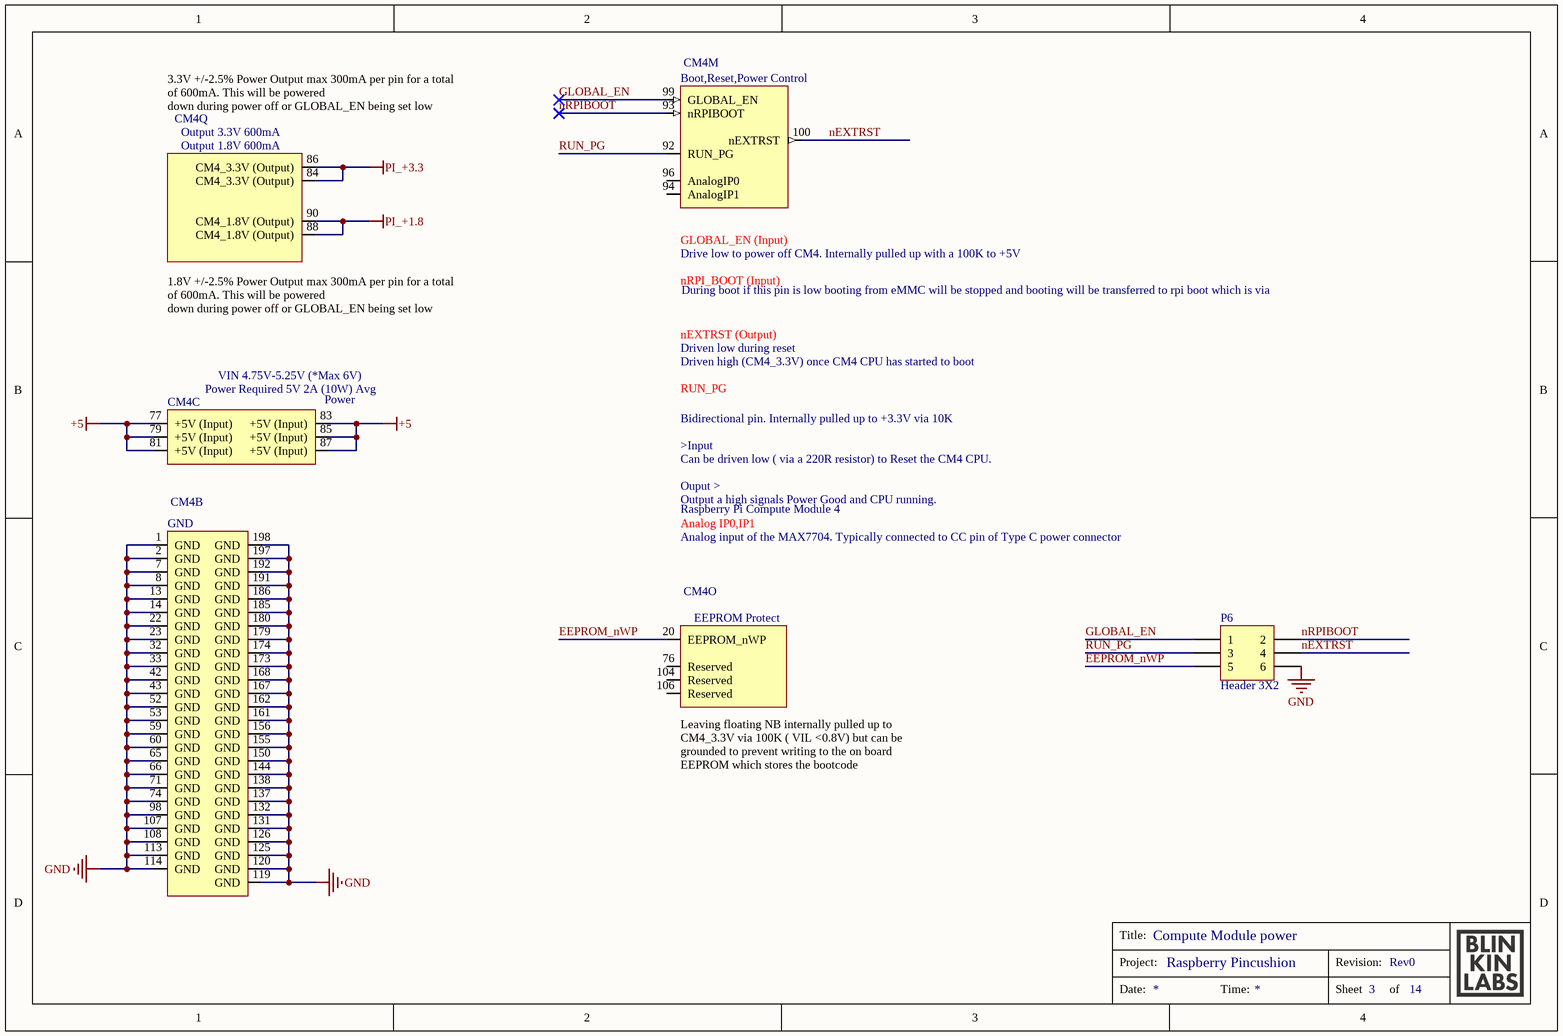
[diagram p5: compute module power.SchDoc]

### Parts
CM4  Raspberry Pi Compute Module 4  [CM4-F40C-100DS-0.4v_1.5mm_0mm]  (value not drawn)  (parts B,C,M,O,Q of 21)
P6  Header 3X2  [HDR2X3]

### Nets
+5: CM4.77(+5V_(Input)) CM4.79(+5V_(Input)) CM4.81(+5V_(Input)) CM4.83(+5V_(Input)) CM4.85(+5V_(Input)) CM4.87(+5V_(Input))
GND: CM4.1(GND) CM4.2(GND) CM4.7(GND) CM4.8(GND) CM4.13(GND) CM4.14(GND) CM4.22(GND) CM4.23(GND) CM4.32(GND) CM4.33(GND) CM4.42(GND) CM4.43(GND) CM4.52(GND) CM4.53(GND) CM4.59(GND) CM4.60(GND) CM4.65(GND) CM4.66(GND) CM4.71(GND) CM4.74(GND) CM4.98(GND) CM4.107(GND) CM4.108(GND) CM4.113(GND) CM4.114(GND) CM4.119(GND) CM4.120(GND) CM4.125(GND) CM4.126(GND) CM4.131(GND) CM4.132(GND) CM4.137(GND) CM4.138(GND) CM4.144(GND) CM4.150(GND) CM4.155(GND) CM4.156(GND) CM4.161(GND) CM4.162(GND) CM4.167(GND) CM4.168(GND) CM4.173(GND) CM4.174(GND) CM4.179(GND) CM4.180(GND) CM4.185(GND) CM4.186(GND) CM4.191(GND) CM4.192(GND) CM4.197(GND) CM4.198(GND) P6.6
PI_+1.8: CM4.88(CM4_1.8V_(Output)) CM4.90(CM4_1.8V_(Output))
PI_+3.3: CM4.84(CM4_3.3V_(Output)) CM4.86(CM4_3.3V_(Output))
EEPROM_nWP: CM4.20(EEPROM_nWP) P6.5
GLOBAL_EN: CM4.99(GLOBAL_EN) P6.1
nEXTRST: CM4.100(nEXTRST) P6.4
nRPIBOOT: CM4.93(nRPIBOOT) P6.2
RUN_PG: CM4.92(RUN_PG) P6.3

Not connected (* = marked no-connect by the designer): CM4 76(Reserved) 94(AnalogIP1) 96(AnalogIP0) 104(Reserved) 106(Reserved)

### Notes on the sheet
- Title:
- Project:
- Revision:
- Date:
- Time:
- Sheet
- of
- (in symbol CM4, part C) VIN 4.75V-5.25V (*Max 6V); Power Required 5V 2A (10W) Avg; Power
- (in symbol CM4, part M) Boot,Reset,Power Control; GLOBAL_EN (Input); Drive low to power off CM4. Internally pulled up with a 100K to +5V; nRPI_BOOT (Input); During boot if this pin is low booting from eMMC will be stopped and booting will be transferred to rpi boot which is via; nEXTRST (Output); Driven low during reset; Driven high (CM4_3.3V) once CM4 CPU has started to boot; Bidirectional pin. Internally pulled up to +3.3V via 10K / >Input / Can be driven low ( via a 220R resistor) to Reset the CM4 CPU. / Ouput > / Output a high signals Power Good and CPU running.; Analog IP0,IP1; Analog input of the MAX7704. Typically connected to CC pin of Type C power connector
- (in symbol CM4, part O) EEPROM Protect; Leaving floating NB internally pulled up to CM4_3.3V via 100K ( VIL <0.8V) but can be / grounded to prevent writing to the on board EEPROM which stores the bootcode
- (in symbol CM4, part Q) 3.3V +/-2.5% Power Output max 300mA per pin for a total of 600mA. This will be powered / down during power off or GLOBAL_EN being set low; Output 3.3V 600mA; Output 1.8V 600mA; 1.8V +/-2.5% Power Output max 300mA per pin for a total of 600mA. This will be powered / down during power off or GLOBAL_EN being set low

### Library data of the parts
CM4 = CM4: as CM4 on sheet compute module
P6 = Header 3X2: Header, 3-Pin, Dual row; LatestRevisionDate: 17-Jul-2002; LatestRevisionNote: Re-released for DXP Platform.; Publisher: Altium Limited

## Sheet Block Diagram.SchDoc: Block diagram
size A4; Organization: Blinkinlabs, LLC; DocumentNumber: 1; SheetNumber: 1; SheetTotal: 14
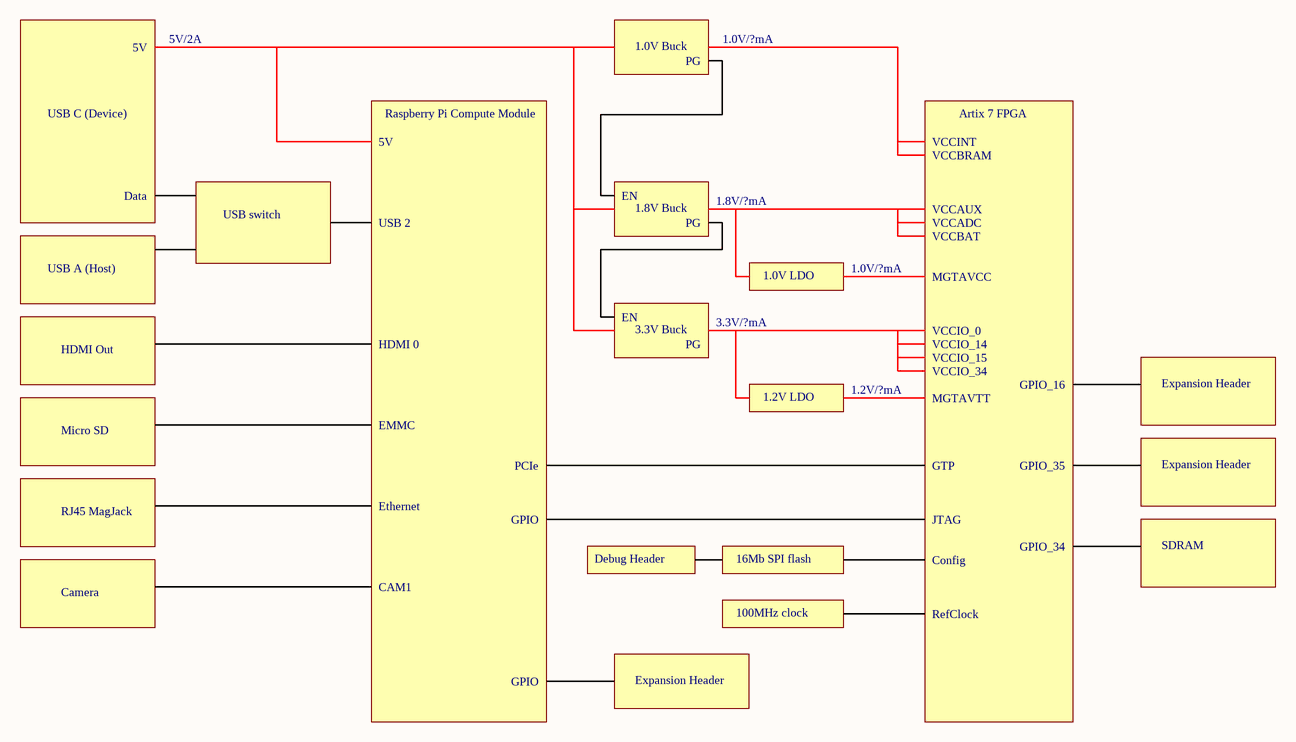
[diagram p6: Block Diagram.SchDoc]

### Notes on the sheet
- 5V
- 5V/2A
- 1.0V Buck
- PG
- 1.0V/?mA
- USB C (Device)
- Raspberry Pi Compute Module
- VCCINT
- Artix 7 FPGA
- Data
- EN
- 1.8V Buck
- 1.8V/?mA
- VCCAUX
- VCCBRAM
- USB A (Host)
- USB switch
- USB 2
- VCCADC
- VCCBAT
- MGTAVCC
- HDMI 0
- 3.3V Buck
- 3.3V/?mA
- 1.0V LDO
- VCCIO_0
- VCCIO_14
- HDMI Out
- 1.2V LDO
- 1.2V/?mA
- MGTAVTT
- VCCIO_15
- VCCIO_34
- GPIO_16
- Expansion Header
- Micro SD
- EMMC
- PCIe
- GTP
- GPIO_35
- RJ45 MagJack
- Ethernet
- GPIO
- JTAG
- GPIO_34
- Camera
- CAM1
- Debug Header
- 100MHz clock
- 16Mb SPI flash
- RefClock
- Config
- SDRAM
- Title:
- Project:
- Revision:
- Date:
- Time:
- Sheet
- of

## Sheet compute module Ethernet.SchDoc: Compute Module Ethernet
size A4; Organization: Blinkinlabs, LLC; DocumentNumber: 4; SheetNumber: 4; SheetTotal: 14
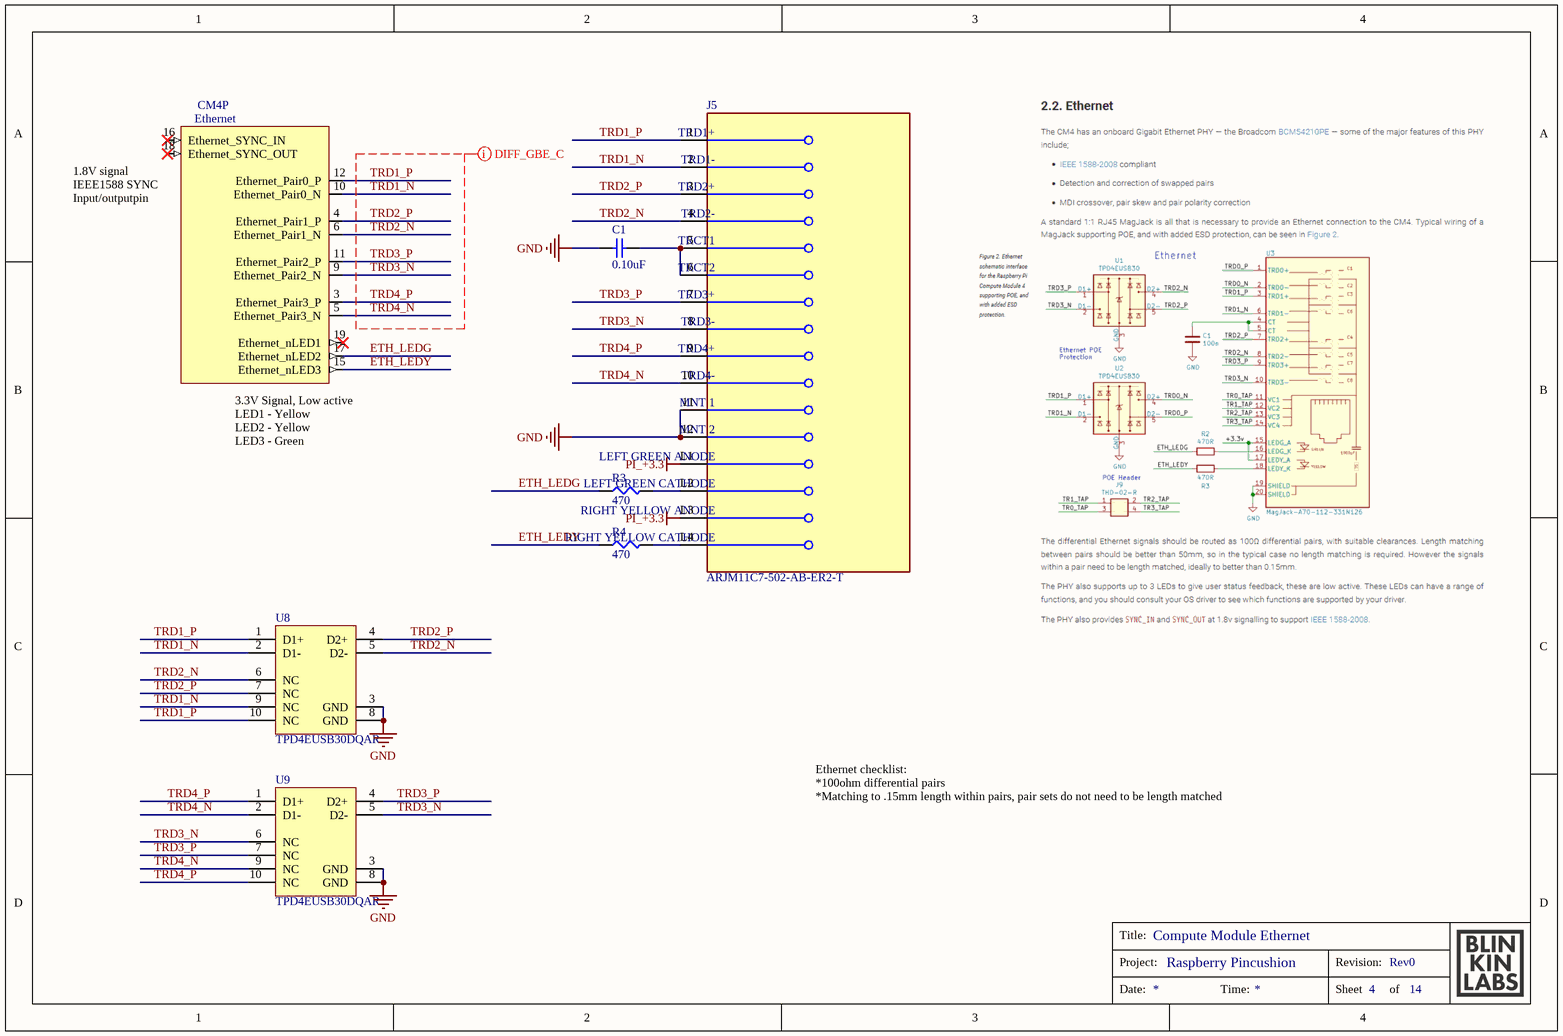
[diagram p7: compute module Ethernet.SchDoc]

### Parts
C1  0.10uF  [CAPC1608X09L]
CM4  Raspberry Pi Compute Module 4  [CM4-F40C-100DS-0.4v_1.5mm_0mm]  (value not drawn)  (part P of 21)
J5  ARJM11C7-502-AB-ER2-T  [FP-ARJM11C7-502-AB-ER2-T-MFG]
R3  470  [ERJ2G(0402)_L]
R4  470  [ERJ2G(0402)_L]
U8  TPD4EUSB30DQAR  [DQA0010A_V]
U9  TPD4EUSB30DQAR  [DQA0010A_V]

### Nets
GND: C1.1 J5.11(MNT_1) J5.12(MNT_2) U8.3(GND) U8.8(GND) U9.3(GND) U9.8(GND)
PI_+3.3: J5.L1(LEFT_GREEN_ANODE) J5.L3(RIGHT_YELLOW_ANODE)
ETH_LEDG: CM4.17(Ethernet_nLED2) R3.1
ETH_LEDY: CM4.15(Ethernet_nLED3) R4.1
TRD1_N: CM4.10(Ethernet_Pair0_N) J5.2(TRD1-) U8.2(D1-) U8.9(NC)
TRD1_P: CM4.12(Ethernet_Pair0_P) J5.1(TRD1+) U8.1(D1+) U8.10(NC)
TRD2_N: CM4.6(Ethernet_Pair1_N) J5.4(TRD2-) U8.5(D2-) U8.6(NC)
TRD2_P: CM4.4(Ethernet_Pair1_P) J5.3(TRD2+) U8.4(D2+) U8.7(NC)
TRD3_N: CM4.9(Ethernet_Pair2_N) J5.8(TRD3-) U9.5(D2-) U9.6(NC)
TRD3_P: CM4.11(Ethernet_Pair2_P) J5.7(TRD3+) U9.4(D2+) U9.7(NC)
TRD4_N: CM4.5(Ethernet_Pair3_N) J5.10(TRD4-) U9.2(D1-) U9.9(NC)
TRD4_P: CM4.3(Ethernet_Pair3_P) J5.9(TRD4+) U9.1(D1+) U9.10(NC)
NetC1_2: C1.2 J5.5(TRCT1) J5.6(TRCT2)
NetJ5_L2: J5.L2(LEFT_GREEN_CATHODE) R3.2
NetJ5_L4: J5.L4(RIGHT_YELLOW_CATHODE) R4.2

Not connected (* = marked no-connect by the designer): CM4 16(Ethernet_SYNC_IN)* 18(Ethernet_SYNC_OUT)* 19(Ethernet_nLED1)*

### Layout directives
differential pair; differential pair class DIFF_100Ohm_GBE; differential pair class DIFF_LAN_GB; net class GBE_1Gbps; rule Matched Net Lengths [Tolerance = 0.15mm]: TRD1_N, TRD1_P, TRD2_N, TRD2_P, TRD3_N, TRD3_P, TRD4_N, TRD4_P

### Notes on the sheet
- Ethernet checklist:
  *100ohm differential pairs
  *Matching to .15mm length within pairs, pair sets do not need to be length matched
- Title:
- Project:
- Revision:
- Date:
- Time:
- Sheet
- of
- (in symbol CM4, part P) Ethernet; 1.8V signal / IEEE1588 SYNC Input/outputpin; by Amornthep Phunsin; 3.3V Signal, Low active / LED1 - Yellow / LED2 - Yellow / LED3 - Green

### Library data of the parts
C1 = GRM188R71H104KA93D: CAP CER 0.1UF 50V X7R 0603; Manufacturer: Murata Electronics North America; Tolerance: ±10%; PartNumber: GRM188R71H104KA93D; Datasheets: http://www.murata.com/~/media/webrenewal/support/library/catalog/products/capacitor/mlcc/c02e.pdf; Image: //media.digikey.com/Renders/Murata%20Renders/ZRB-SERIES-0402.jpg; Digi-Key Part Number: 490-1519-1-ND; Series: GRM; Value: 0.10uF; Voltage: 50V; Temperature Coefficient: X7R; Operating Temperature: -55°C ~ 125°C; Features: -; Applications: General Purpose; Package / Case: 0603 (1608 Metric); Case/Package: 0603
CM4 = CM4: as CM4 on sheet compute module
J5 = CMP-27893-000001-1: RJ45 JACK W/MAG 1X1 1000BASE-T; Manufacturer: Abracon; Conn Gender: Female; Is Female: yes; Shielding: true; Pitch: 1.27mm; Number Of Contacts: 10; Conn Orientation: Right Angle; RoHS: TRUE; Digikey Description: RJ45 JACK W/MAG 1X1 1000BASE-T; Temperature Range Low: -40°C; ComponentLink2Description: Datasheet; Category: Conn; Temperature Range High: +85°C; Package: 0; Device Class L1: Connectors; Manufacturer Part Number: ARJM11C7-502-AB-ER2-T; ComponentLink2URL: https://abracon.com/Magnetics/ARJM11.pdf; Automotive: No; Contact Material: Gold; Height: 15.8mm; Lead Free: Yes; Temperature: -40°C to +85°C; Device Class L2: Modular / Ethernet Connectors; Device Class L3: unset; Octopart: https://octopart.com/arjm11c7-502-ab-er2-t-abracon-86945316
R3 R4 = ERJ-2GEJ471X: RES SMD 470 OHM 5% 1/10W 0402; Manufacturer: Panasonic Electronic Components; Power (Watts): 0.1W, 1/10W; Temperature Coefficient: ±200ppm/°C; PartNumber: ERJ-2GEJ471X; Datasheets: http://industrial.panasonic.com/www-cgi/jvcr13pz.cgi?E+PZ+3+AOA0001+ERJ2GEJ471X+7+WW; Image: //media.digikey.com/Photos/Panasonic%20Photos/ERJ-PA2-Series.jpg; Digi-Key Part Number: P470JCT-ND; Series: ERJ; Value: 470; Tolerance: ±5%; Composition: Thick Film; Features: Automotive AEC-Q200; Operating Temperature: -55°C ~ 155°C; Package / Case: 0402 (1005 Metric); Case/Package: 0402; Size / Dimension: 0.039" L x 0.020" W (1.00mm x 0.50mm); Height - Seated (Max): 0.016" (0.40mm); Number of Terminations: 2
U8 U9 = CMP-0326-00027-3: ESD Solution for Super-Speed (6 GBPS) USB 3.0 Interface, 4 Channels, -40 to +85 degC, 10-pin SON (DQA), Green (RoHS & no Sb/Br); Manufacturer: Texas Instruments; Differential Capacitance(pF): 0.05; Serial ATA / eSATA: TRUE; IO Capacitance(Typ)(pF): 0.8; IO Leakage Current(nA): 10; IEC 61000-4-2 Air-Gap(+/- kV): 8; ComponentLink3Description: URL Link1; PartNumber: TPD4EUSB30DQAR; DatasheetVersion: SLVSAC2C; ComponentLink2URL: http://www.ti.com/general/docs/lit/getliterature.tsp?genericPartNumber=TPD4EUSB30&fileType=pdf; USB Super Speed: TRUE; Eco-Plan: Green (RoHS & no Sb/Br); Mounting Technology: Surface Mount; 1394 / Firewire: TRUE; PackageVersion: revB, Sep-2009; SubFamily: ESD Solution; USB Full Speed: TRUE; USB High Speed: TRUE; ComponentLink2Description: Datasheet; ComponentLink1URL: http://www.ti.com/; IEC 61000-4-2 Contact(+/- kV): 8; Breakdown Voltage(Min)(V): 8; PackageReference: DQA0010A; ComponentLink1Description: Manufacturer URL; PackageDescription: 10-Pin Plastic Small Outline No-Lead, 1 x 2.5 x 0.55 mm Body, 0.5 mm Pitch; ComponentLink3URL: SamplesURL:http://www.ti.com/product/tpd4eusb30#samples; HDMI: TRUE

## Sheet compute module HDMI out.SchDoc: Compute Module HDMI/Camera
size A4; Organization: Blinkinlabs, LLC; DocumentNumber: 5; SheetNumber: 5; SheetTotal: 14
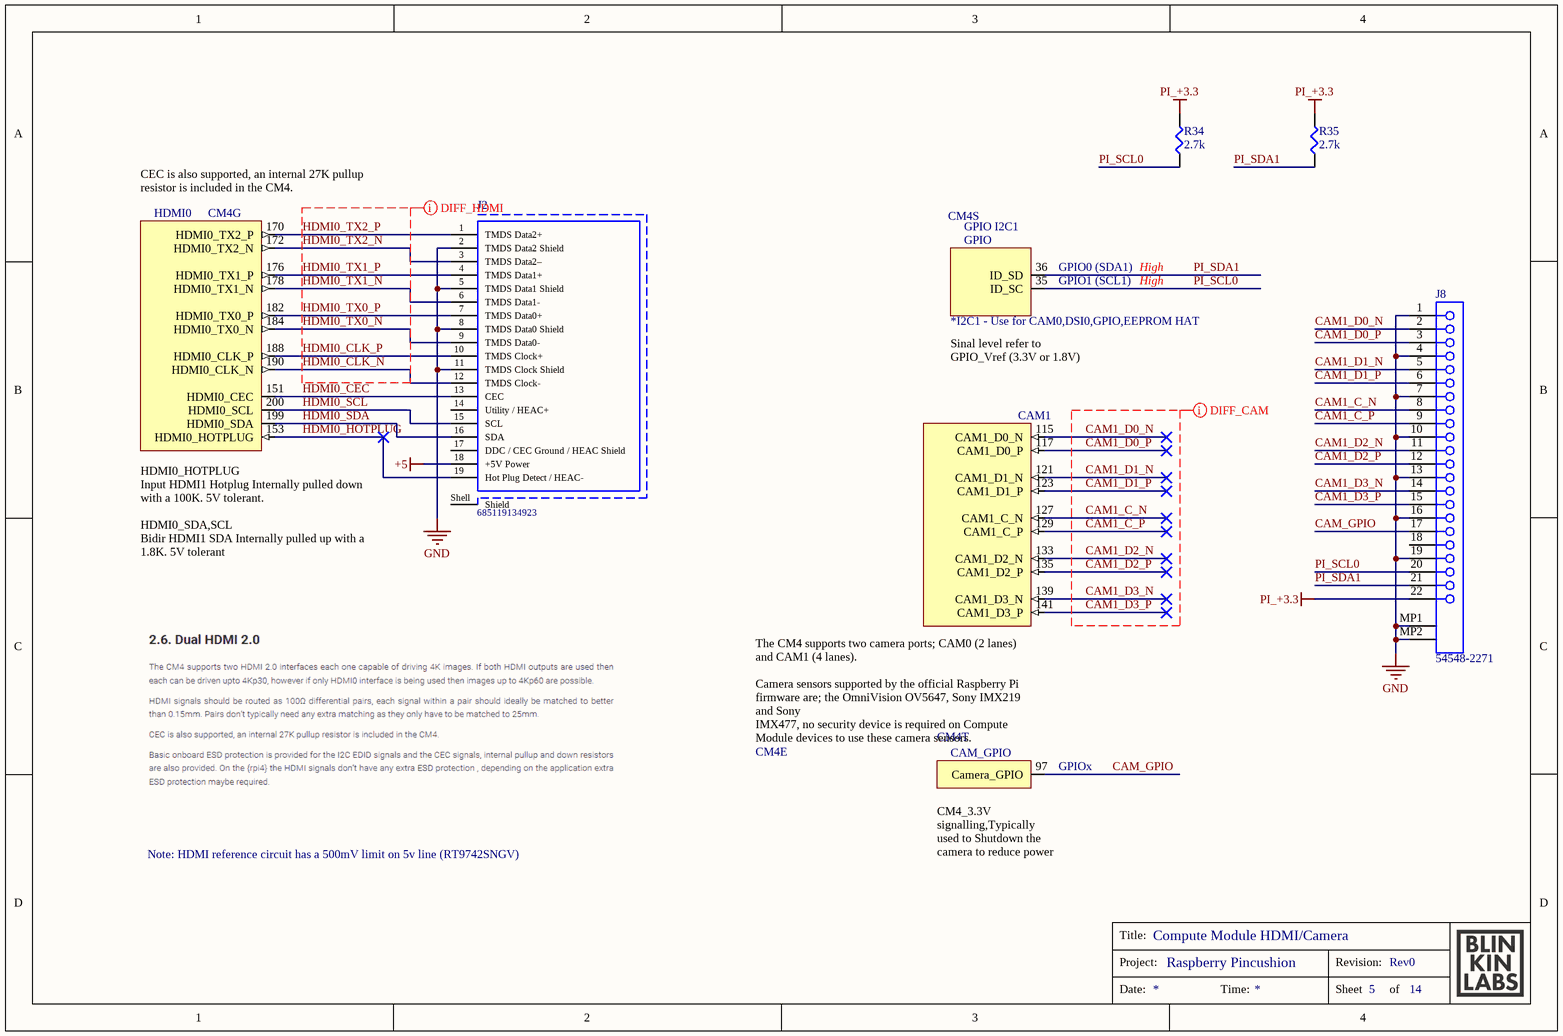
[diagram p8: compute module HDMI out.SchDoc]

### Parts
CM4  Raspberry Pi Compute Module 4  [CM4-F40C-100DS-0.4v_1.5mm_0mm]  (value not drawn)  (parts E,G,S,T of 21)
J2  685119134923  [685119134923]
J8  54548-2271  [MOLX-54548-2271]
R34  2.7k  [ERJ2G(0402)_L]
R35  2.7k  [ERJ2G(0402)_L]

### Nets
+5: J2.18(+5V_Power)
GND: J2.2(TMDS_Data2_Shield) J2.5(TMDS_Data1_Shield) J2.8(TMDS_Data0_Shield) J2.11(TMDS_Clock_Shield) J8.1 J8.4 J8.7 J8.10 J8.13 J8.16 J8.19 J8.MP1 J8.MP2
PI_+3.3: J8.22 R34.2 R35.2
CAM1_C_N: CM4.127(CAM1_C_N) J8.8
CAM1_C_P: CM4.129(CAM1_C_P) J8.9
CAM1_D0_N: CM4.115(CAM1_D0_N) J8.2
CAM1_D0_P: CM4.117(CAM1_D0_P) J8.3
CAM1_D1_N: CM4.121(CAM1_D1_N) J8.5
CAM1_D1_P: CM4.123(CAM1_D1_P) J8.6
CAM1_D2_N: CM4.133(CAM1_D2_N) J8.11
CAM1_D2_P: CM4.135(CAM1_D2_P) J8.12
CAM1_D3_N: CM4.139(CAM1_D3_N) J8.14
CAM1_D3_P: CM4.141(CAM1_D3_P) J8.15
CAM_GPIO: CM4.97(Camera_GPIO) J8.17
HDMI0_CEC: CM4.151(HDMI0_CEC) J2.13(CEC)
HDMI0_CLK_N: CM4.190(HDMI0_CLK_N) J2.12(TMDS_Clock-)
HDMI0_CLK_P: CM4.188(HDMI0_CLK_P) J2.10(TMDS_Clock+)
HDMI0_HOTPLUG: CM4.153(HDMI0_HOTPLUG) J2.19(Hot_Plug_Detect_/_HEAC-)
HDMI0_SCL: CM4.200(HDMI0_SCL) J2.15(SCL)
HDMI0_SDA: CM4.199(HDMI0_SDA) J2.16(SDA)
HDMI0_TX0_N: CM4.184(HDMI0_TX0_N) J2.9(TMDS_Data0-)
HDMI0_TX0_P: CM4.182(HDMI0_TX0_P) J2.7(TMDS_Data0+)
HDMI0_TX1_N: CM4.178(HDMI0_TX1_N) J2.6(TMDS_Data1-)
HDMI0_TX1_P: CM4.176(HDMI0_TX1_P) J2.4(TMDS_Data1+)
HDMI0_TX2_N: CM4.172(HDMI0_TX2_N) J2.3(TMDS_Data2–)
HDMI0_TX2_P: CM4.170(HDMI0_TX2_P) J2.1(TMDS_Data2+)
PI_SCL0: CM4.35(ID_SC) J8.20 R34.1
PI_SDA1: CM4.36(ID_SD) J8.21 R35.1

Not connected (* = marked no-connect by the designer): J2 14(Utility_/_HEAC+) 17(DDC_/_CEC_Ground_/_HEAC_Shield) Shell(Shield); J8 18

### Layout directives
differential pair; differential pair class DIFF_100Ohm_HDMI; differential pair class DIFF_HDMI; net class HDMI; rule Matched Net Lengths [Tolerance = 0.15mm]: HDMI0_CLK_N, HDMI0_CLK_P, HDMI0_TX0_N, HDMI0_TX0_P, HDMI0_TX1_N, HDMI0_TX1_P, HDMI0_TX2_N, HDMI0_TX2_P
differential pair; differential pair class DIFF_100Ohm_HDMI; differential pair class DIFF_CAM; net class CAM; rule Matched Net Lengths [Tolerance = 0.15mm]: CAM1_C_N, CAM1_C_P, CAM1_D0_N, CAM1_D0_P, CAM1_D1_N, CAM1_D1_P, CAM1_D2_N, CAM1_D2_P, CAM1_D3_N, CAM1_D3_P

### Notes on the sheet
- Note: HDMI reference circuit has a 500mV limit on 5v line (RT9742SNGV)
- Title:
- Project:
- Revision:
- Date:
- Time:
- Sheet
- of
- (in symbol CM4, part E) CAM1; The CM4 supports two camera ports; CAM0 (2 lanes) and CAM1 (4 lanes). / Camera sensors supported by the official Raspberry Pi firmware are; the OmniVision OV5647, Sony IMX219 and Sony / IMX477, no security device is required on Compute Module devices to use these camera sensors.
- (in symbol CM4, part G) CEC is also supported, an internal 27K pullup resistor is included in the CM4.; HDMI0; HDMI0_HOTPLUG / Input HDMI1 Hotplug Internally pulled down with a 100K. 5V tolerant.; HDMI0_SDA,SCL / Bidir HDMI1 SDA Internally pulled up with a 1.8K. 5V tolerant
- (in symbol CM4, part S) GPIO I2C1; GPIO; GPIO0 (SDA1); High; GPIO1 (SCL1); *I2C1 - Use for CAM0,DSI0,GPIO,EEPROM HAT; Sinal level refer to  GPIO_Vref (3.3V or 1.8V)
- (in symbol CM4, part T) CAM_GPIO; GPIOx; CM4_3.3V signalling,Typically used to Shutdown the camera to reduce power

### Library data of the parts
CM4 = CM4: as CM4 on sheet compute module
J2 = CMP-1502-00169-1: HDMI Type A Receptacle WR-HDMI, Horizontal, SMT; Manufacturer: Wurth Elektronik; Contact Resistance: 30mOhm; Working Voltage: 40VDC; Rated Current: 0.5A; Publisher: WurthElektronik; Datasheet URL: https://katalog.we-online.de/em/datasheet/685119134923.pdf; Gender: Receptacle; Manufacturer URL: http://www.we-online.de; Orientation: Horizontal; Mounting Technology: SMT; Part Number: 685119134923; Packaging: TapeandReel; Package Reference: 685119134923; Operating Temperature: -20to85degC; Connector Type: HDMITypeA
J8 = CMP-1241-00555-1: 0.5 mm Pitch Easy-On(TM) Type FPC Connector, 1.2 mm Mated Height, Right Angle, ZIF, SMT, Bottom Contact, 22 Circuits, -20 to 85 degC, ELV and RoHS Compliant, Tape and Reel; Manufacturer: Molex; Circuits (Loaded): 22; Stackable: No; Material - Plating Termination: Tin; PCB Retention: Yes; Entry Angle: 90degrees Angle; Material - Plating Mating: Gold; Current (Max per Contact): 0.5A; Material - Metal: Phosphor Bronze; Voltage (Max): 50V; Mated Height: 1.20mm; Pitch - Mating Interface: 0.50mm; Durability (mating cycles max): 20; PackageVersion: Rev. N, 06/2008; PackageDescription: 22-Lead FPC Connector, Pitch 0.5 mm; PackageReference: 54548-2271; ComponentLink2Description: Datasheet; PartNumber: 54548-2271; ComponentLink3URL: http://www.molex.com/pdm_docs/sd/545482171_sd.pdf; Contact Position: Bottom; Packing: Tape and Reel; ComponentLink1URL: http://www.molex.com/molex/index.jsp; Mounting Technology: Surface Mount; ComponentLink3Description: Package Specification; PCB Locator: No; ComponentLink2URL: http://www.molex.com/webdocs/datasheets/pdf/en-us/0545482271_FFC_FPC_CONNECTORS.pdf; Orientation: Right Angle; Number of Rows: 1; RoHS: TRUE; Polarized to PCB: Yes; ComponentLink1Description: Manufacturer URL
R34 R35 = ERJ-2RKF2701X: RES SMD 2.7K OHM 1% 1/10W 0402; Manufacturer: Panasonic Electronic Components; Power (Watts): 0.1W, 1/10W; Temperature Coefficient: ±100ppm/°C; PartNumber: ERJ-2RKF2701X; Datasheets: http://industrial.panasonic.com/www-cgi/jvcr13pz.cgi?E+PZ+3+AOA0002+ERJ2RKF2701X+7+WW; Image: //media.digikey.com/Photos/Panasonic%20Photos/ERJ-PA2-Series.jpg; Digi-Key Part Number: P2.70KLCT-ND; Series: ERJ; Value: 2.7k; Tolerance: ±1%; Composition: Thick Film; Features: Automotive AEC-Q200; Operating Temperature: -55°C ~ 155°C; Package / Case: 0402 (1005 Metric); Case/Package: 0402; Size / Dimension: 0.039" L x 0.020" W (1.00mm x 0.50mm); Height - Seated (Max): 0.016" (0.40mm); Number of Terminations: 2

## Sheet compute module microsd.SchDoc: Compute Module MicroSD
size A4; Organization: Blinkinlabs, LLC; DocumentNumber: 6; SheetNumber: 6; SheetTotal: 14
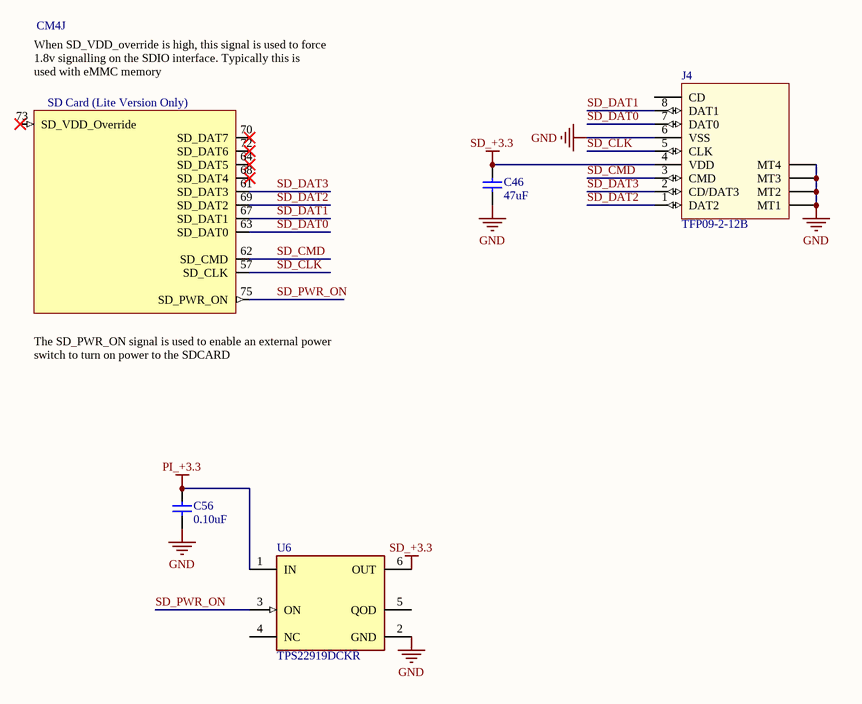
[diagram p9: compute module microsd.SchDoc]

### Parts
C46  47uF  [CAPC1608X09L]
C56  0.10uF  [CAPC1005X06L]
CM4  Raspberry Pi Compute Module 4  [CM4-F40C-100DS-0.4v_1.5mm_0mm]  (value not drawn)  (part J of 21)
J4  TFP09-2-12B  [TFP09-2-12B]
U6  TPS22919DCKR  [FP-DCK0006A-MFG]

### Nets
GND: C46.2 C56.1 J4.6(VSS) J4.MT1 J4.MT2 J4.MT3 J4.MT4 U6.2(GND)
PI_+3.3: C56.2 U6.1(IN)
SD_+3.3: C46.1 J4.4(VDD) U6.6(OUT)
SD_CLK: CM4.57(SD_CLK) J4.5(CLK)
SD_CMD: CM4.62(SD_CMD) J4.3(CMD)
SD_DAT0: CM4.63(SD_DAT0) J4.7(DAT0)
SD_DAT1: CM4.67(SD_DAT1) J4.8(DAT1)
SD_DAT2: CM4.69(SD_DAT2) J4.1(DAT2)
SD_DAT3: CM4.61(SD_DAT3) J4.2(CD/DAT3)
SD_PWR_ON: CM4.75(SD_PWR_ON) U6.3(ON)

Not connected (* = marked no-connect by the designer): CM4 64(SD_DAT5)* 68(SD_DAT4)* 70(SD_DAT7)* 72(SD_DAT6)* 73(SD_VDD_Override)*; J4 CD; U6 4(NC) 5(QOD)

### Notes on the sheet
- Title:
- Project:
- Revision:
- Date:
- Time:
- Sheet
- of
- (in symbol CM4, part J) When SD_VDD_override is high, this signal is used to force 1.8v signalling on the SDIO interface. Typically this is / used with eMMC memory; SD Card (Lite Version Only); by Amornthep Phunsin; The SD_PWR_ON signal is used to enable an external power switch to turn on power to the SDCARD

### Library data of the parts
C46 = ZRB18AR60J476ME01L: CAP CER 47UF 6.3V X5R 0603; Manufacturer: Murata Electronics North America; Tolerance: ±20%; PartNumber: ZRB18AR60J476ME01L; Datasheets: http://psearch.en.murata.com/capacitor/product/ZRB18AR60J476ME01%23.pdf; Image: //media.digikey.com/Renders/Murata%20Renders/ZRB-SERIES-0603.jpg; Digi-Key Part Number: 490-13255-1-ND; Series: ZRB; Value: 47uF; Voltage: 6.3V; Temperature Coefficient: X5R; Operating Temperature: -55°C ~ 85°C; Features: Derating Recommended, Interposer Termination; Applications: Acoustic Noise Reduction; Package / Case: 0603 (1608 Metric); Case/Package: 0603
C56 = GRM155R61A104KA01D: as C82 on sheet FPGA programming; PartNumber: GRM155R61A104KA01D; Datasheets: http://www.murata.com/~/media/webrenewal/support/library/catalog/products/capacitor/mlcc/c02e.pdf; Image: //media.digikey.com/Renders/Murata%20Renders/ZRB-SERIES-0402.jpg; Digi-Key Part Number: 490-1318-1-ND; Packaging: Cut Tape (CT); Series: GRM; Value: 0.10uF; Voltage: 10V; Temperature Coefficient: X5R; Operating Temperature: -55°C ~ 85°C; Features: -; Applications: General Purpose; Package / Case: 0402 (1005 Metric); Case/Package: 0402
CM4 = CM4: as CM4 on sheet compute module
J4 = TFP09-2-12B: Micro SD Card Connector; Manufacturer: Unknown/Generic; PartNumber: TFP09-2-12B
U6 = CMP-04912-000027-1: POWER MANAGEMENT